# EAGLE design STM32F767ZI_eval_1 (EAGLE 7.7.0)

## Sheet 1 of 5
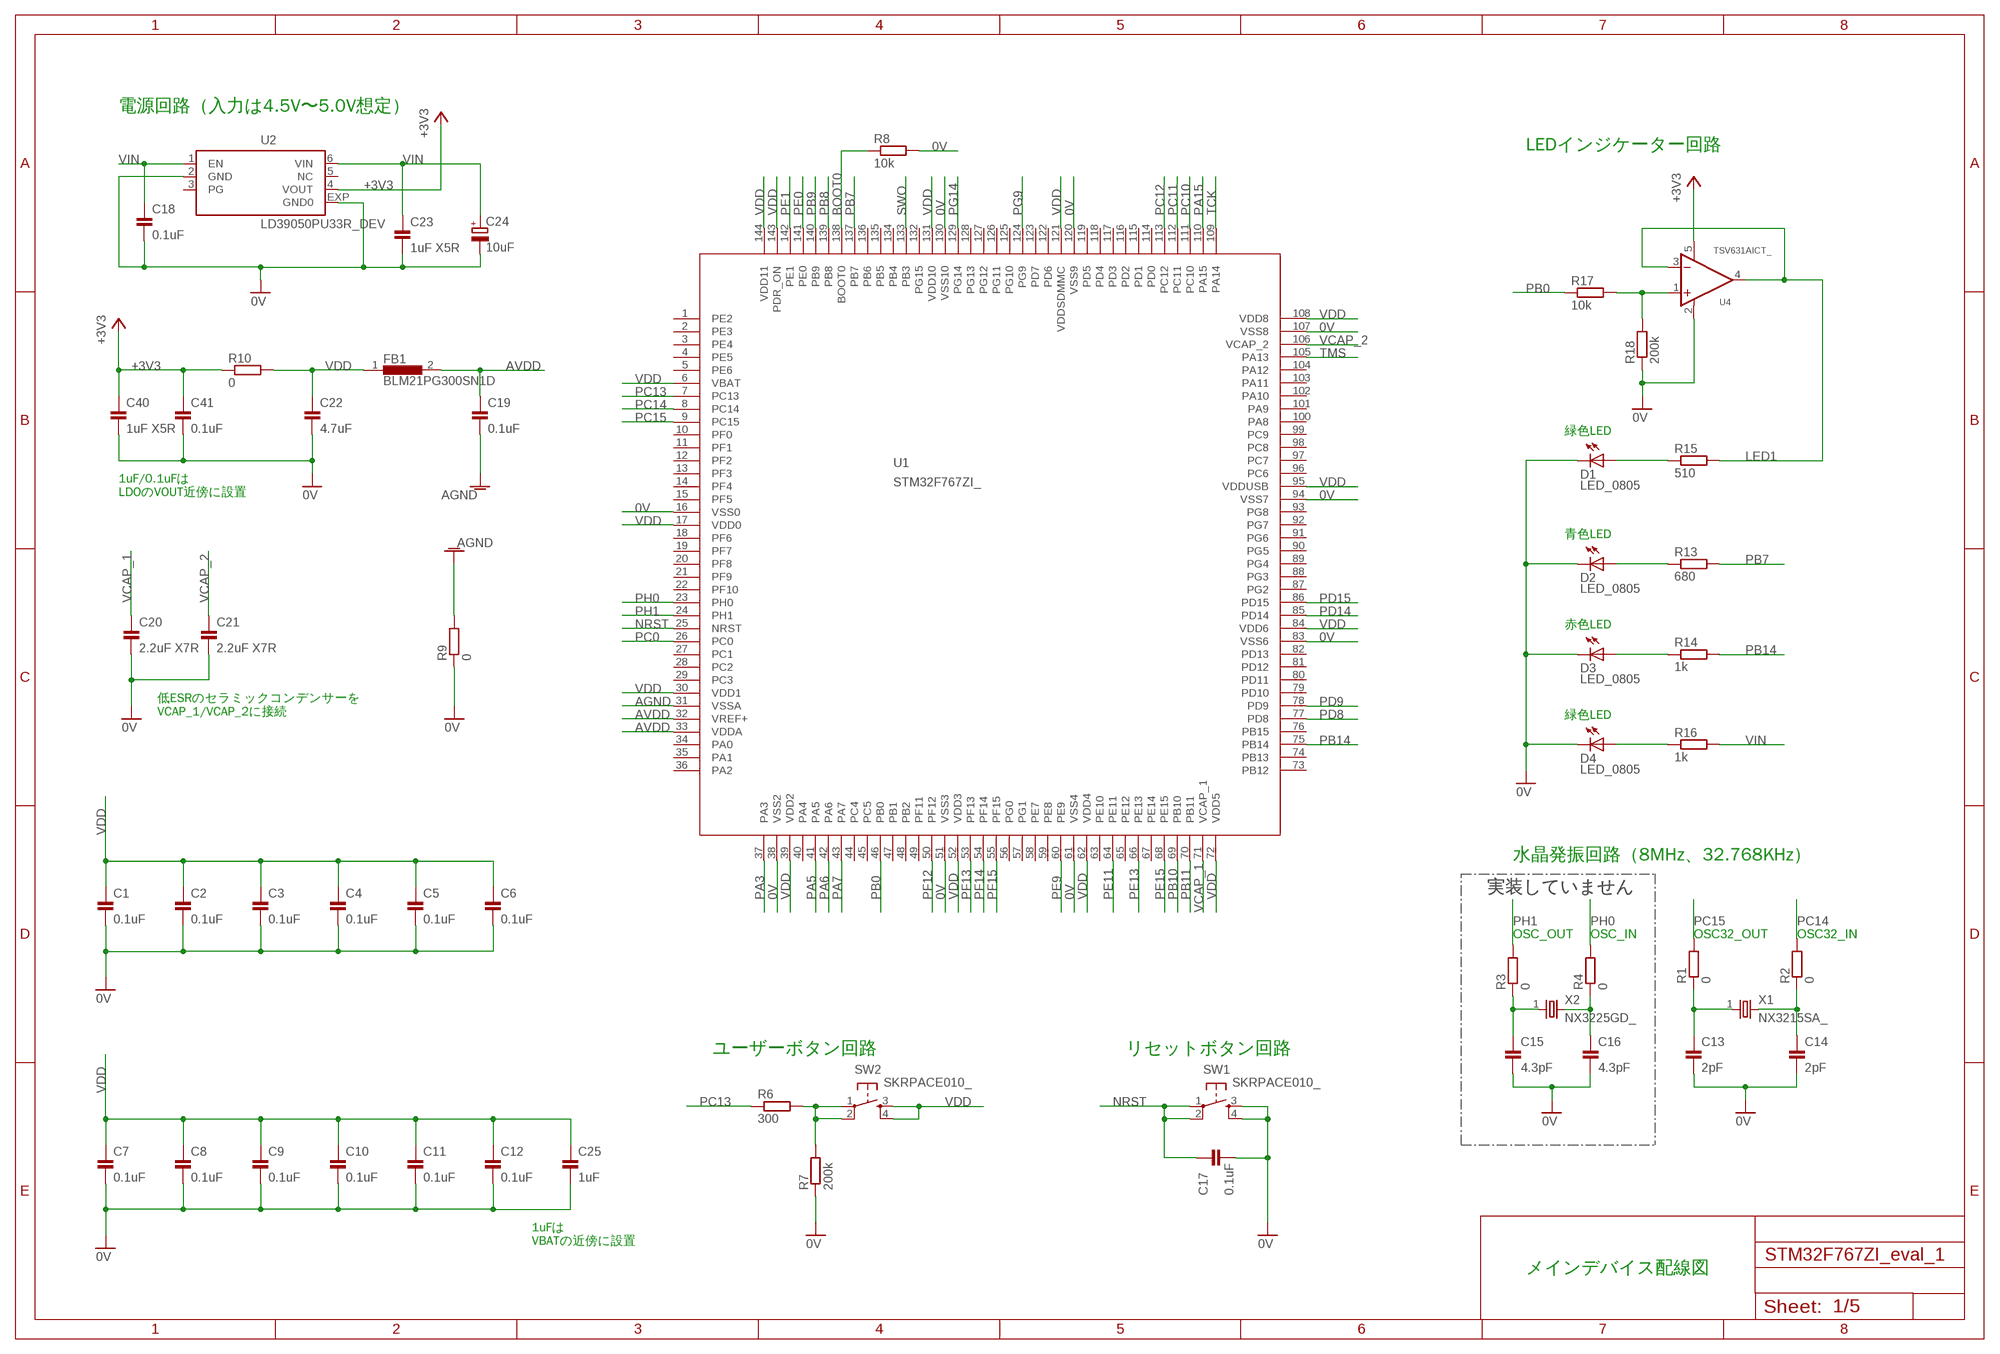
[diagram p0: schematic, sheet 1]

### Parts
C1  0.1uF  CAP_0603_DEV  [SMD_1608_DEV]
C2  0.1uF  CAP_0603_DEV  [SMD_1608_DEV]
C3  0.1uF  CAP_0603_DEV  [SMD_1608_DEV]
C4  0.1uF  CAP_0603_DEV  [SMD_1608_DEV]
C5  0.1uF  CAP_0603_DEV  [SMD_1608_DEV]
C6  0.1uF  CAP_0603_DEV  [SMD_1608_DEV]
C7  0.1uF  CAP_0603_DEV  [SMD_1608_DEV]
C8  0.1uF  CAP_0603_DEV  [SMD_1608_DEV]
C9  0.1uF  CAP_0603_DEV  [SMD_1608_DEV]
C10  0.1uF  CAP_0603_DEV  [SMD_1608_DEV]
C11  0.1uF  CAP_0603_DEV  [SMD_1608_DEV]
C12  0.1uF  CAP_0603_DEV  [SMD_1608_DEV]
C13  2pF  CAP_0603_DEV  [SMD_1608_DEV]
C14  2pF  CAP_0603_DEV  [SMD_1608_DEV]
C15  4.3pF  CAP_0603_DEV  [SMD_1608_DEV]
C16  4.3pF  CAP_0603_DEV  [SMD_1608_DEV]
C17  0.1uF  CAP_0603_DEV  [SMD_1608_DEV]
C18  0.1uF  CAP_0603_DEV  [SMD_1608_DEV]
C19  0.1uF  CAP_0603_DEV  [SMD_1608_DEV]
C20  2.2uF X7R  CAP_1206  [C1206]
C21  2.2uF X7R  CAP_1206  [C1206]
C22  4.7uF  CAP_0805_DEV  [SMD_2012_DEV]
C23  1uF X5R  CAP_0603_DEV  [SMD_1608_DEV]
C24  10uF  TPST106K016R0800_  [C1210_TPST_DEV]
C25  1uF  CAP_0603_DEV  [SMD_1608_DEV]
C40  1uF X5R  CAP_0603_DEV  [SMD_1608_DEV]
C41  0.1uF  CAP_0603_DEV  [SMD_1608_DEV]
D1  LED_0805  [CHIPLED_0805]
D2  LED_0805  [CHIPLED_0805]
D3  LED_0805  [CHIPLED_0805]
D4  LED_0805  [CHIPLED_0805]
FB1  BLM21PG300SN1D  [SMD_2012_DEV]
R1  0  RESISTOR_0603_DEV  [SMD_1608_DEV]
R2  0  RESISTOR_0603_DEV  [SMD_1608_DEV]
R3  0  RESISTOR_0603_DEV  [SMD_1608_DEV]
R4  0  RESISTOR_0603_DEV  [SMD_1608_DEV]
R6  300  RESISTOR_0603_DEV  [SMD_1608_DEV]
R7  200k  RESISTOR_0603_DEV  [SMD_1608_DEV]
R8  10k  RESISTOR_0603_DEV  [SMD_1608_DEV]
R9  0  RESISTOR_0603_DEV  [SMD_1608_DEV]
R10  0  RESISTOR_0603_DEV  [SMD_1608_DEV]
R13  680  RESISTOR_0603_DEV  [SMD_1608_DEV]
R14  1k  RESISTOR_0603_DEV  [SMD_1608_DEV]
R15  510  RESISTOR_0603_DEV  [SMD_1608_DEV]
R16  1k  RESISTOR_0603_DEV  [SMD_1608_DEV]
R17  10k  RESISTOR_0603_DEV  [SMD_1608_DEV]
R18  200k  RESISTOR_0603_DEV  [SMD_1608_DEV]
SW1  SKRPACE010_  [SKRPACE010_DEV]
SW2  SKRPACE010_  [SKRPACE010_DEV]
U1  STM32F767ZI_  [LQFP144_DEV]
U2  LD39050PU33R_DEV  [DFN6-3X3_]
U4  TSV631AICT_  [SC-70-5_DEV]
X1  NX3215SA_  [NX3215_DEV]
X2  NX3225GD_  [NX3225_DEV]

### Nets
0V: C1.2 C2.2 C3.2 C4.2 C5.2 C6.2 C7.2 C8.2 C9.2 C10.2 C11.2 C12.2 C13.2 C14.2 C15.2 C16.2 C17.2 C18.2 C20.2 C21.2 C22.2 C23.2 C24.2(-) C25.2 C40.2 C41.2 D1.C D2.C D3.C D4.C R7.1 R8.2 R9.1 R18.1 SW1.3(S) SW1.4(S1) U1.16(VSS0) U1.38(VSS2) U1.51(VSS3) U1.61(VSS4) U1.83(VSS6) U1.94(VSS7) U1.107(VSS8) U1.120(VSS9) U1.130(VSS10) U2.2(GND) U2.EXP(GND0) U4.2(V-) ; also sheet 2,3,4,5
+3V3: C40.1 C41.1 R10.1 U2.4(VOUT) U4.5(V+) ; also sheet 2,3,4
AGND: C19.2 R9.2 U1.31(VSSA)
AVDD: C19.1 FB1.2 U1.32(VREF+) U1.33(VDDA) ; also sheet 2
BOOT0: R8.1 U1.138(BOOT0)
LED1: R15.2 U4.3(IN-) U4.4(OUT)
N$1: C15.1 R3.1 X2.1
N$2: C14.1 R2.1 X1.2
N$3: C13.1 R1.1 X1.1
N$4: D2.A R13.1
N$5: C16.1 R4.1 X2.2
N$6: R6.2 R7.2 SW2.1(P) SW2.2(P1)
N$7: D3.A R14.1
N$9: R17.2 R18.2 U4.1(IN+)
N$10: D1.A R15.1
N$11: D4.A R16.1
NRST: C17.1 SW1.1(P) SW1.2(P1) U1.25(NRST) ; also sheet 2
PA3: U1.37(PA3) ; also sheet 2
PA5: U1.41(PA5) ; also sheet 2,3
PA6: U1.42(PA6) ; also sheet 2
PA7: U1.43(PA7) ; also sheet 2,3
PA15: U1.110(PA15) ; also sheet 4
PB0: R17.1 U1.46(PB0)
PB7: R13.2 U1.137(PB7)
PB8: U1.139(PB8) ; also sheet 2
PB9: U1.140(PB9) ; also sheet 2
PB10: U1.69(PB10) ; also sheet 5
PB11: U1.70(PB11) ; also sheet 5
PB14: R14.2 U1.75(PB14)
PC0: U1.26(PC0) ; also sheet 2
PC10: U1.111(PC10) ; also sheet 4
PC11: U1.112(PC11) ; also sheet 4
PC12: U1.113(PC12) ; also sheet 4
PC13: R6.1 U1.7(PC13)
PC14: R2.2 U1.8(PC14)
PC15: R1.2 U1.9(PC15)
PD8: U1.77(PD8) ; also sheet 2
PD9: U1.78(PD9) ; also sheet 2
PD14: U1.85(PD14) ; also sheet 2,3
PD15: U1.86(PD15) ; also sheet 2,3
PE0: U1.141(PE0) ; also sheet 2
PE1: U1.142(PE1) ; also sheet 2
PE9: U1.60(PE9) ; also sheet 2
PE11: U1.64(PE11) ; also sheet 2
PE13: U1.66(PE13) ; also sheet 2
PE15: U1.68(PE15) ; also sheet 5
PF12: U1.50(PF12) ; also sheet 2,3
PF13: U1.53(PF13) ; also sheet 2
PF14: U1.54(PF14) ; also sheet 2
PF15: U1.55(PF15) ; also sheet 2
PG9: U1.124(PG9) ; also sheet 2
PG14: U1.129(PG14) ; also sheet 2
PH0: R4.2 U1.23(PH0)
PH1: R3.2 U1.24(PH1)
SWO: U1.133(PB3) ; also sheet 2
TCK: U1.109(PA14) ; also sheet 2
TMS: U1.105(PA13) ; also sheet 2
VCAP_1: C20.1 U1.71(VCAP_1)
VCAP_2: C21.1 U1.106(VCAP_2)
VDD: C1.1 C2.1 C3.1 C4.1 C5.1 C6.1 C7.1 C8.1 C9.1 C10.1 C11.1 C12.1 C22.1 C25.1 FB1.1 R10.2 SW2.3(S) SW2.4(S1) U1.6(VBAT) U1.17(VDD0) U1.30(VDD1) U1.39(VDD2) U1.52(VDD3) U1.62(VDD4) U1.72(VDD5) U1.84(VDD6) U1.95(VDDUSB) U1.108(VDD8) U1.121(VDDSDMMC) U1.131(VDD10) U1.143(PDR_ON) U1.144(VDD11) ; also sheet 5
VIN: C18.1 C23.1 C24.1(+) R16.2 U2.1(EN) U2.6(VIN) ; also sheet 2
Unconnected: U1.1(PE2) U1.2(PE3) U1.3(PE4) U1.4(PE5) U1.5(PE6) U1.10(PF0) U1.11(PF1) U1.12(PF2) U1.13(PF3) U1.14(PF4) U1.15(PF5) U1.18(PF6) U1.19(PF7) U1.20(PF8) U1.21(PF9) U1.22(PF10) U1.27(PC1) U1.28(PC2) U1.29(PC3) U1.34(PA0) U1.35(PA1) U1.36(PA2) U1.40(PA4) U1.44(PC4) U1.45(PC5) U1.47(PB1) U1.48(PB2) U1.49(PF11) U1.56(PG0) U1.57(PG1) U1.58(PE7) U1.59(PE8) U1.63(PE10) U1.65(PE12) U1.67(PE14) U1.73(PB12) U1.74(PB13) U1.76(PB15) U1.79(PD10) U1.80(PD11) U1.81(PD12) U1.82(PD13) U1.87(PG2) U1.88(PG3) U1.89(PG4) U1.90(PG5) U1.91(PG6) U1.92(PG7) U1.93(PG8) U1.96(PC6) U1.97(PC7) U1.98(PC8) U1.99(PC9) U1.100(PA8) U1.101(PA9) U1.102(PA10) U1.103(PA11) U1.104(PA12) U1.114(PD0) U1.115(PD1) U1.116(PD2) U1.117(PD3) U1.118(PD4) U1.119(PD5) U1.122(PD6) U1.123(PD7) U1.125(PG10) U1.126(PG11) U1.127(PG12) U1.128(PG13) U1.132(PG15) U1.134(PB4) U1.135(PB5) U1.136(PB6) U2.3(PG) U2.5(NC)

### Notes on the sheet
- 電源回路（入力は4.5V〜5.0V想定）
- LEDインジケーター回路
- 緑色LED
- 1uF/0.1uFは
  LDOのVOUT近傍に設置
- 青色LED
- 赤色LED
- 低ESRのセラミックコンデンサーを
  VCAP_1/VCAP_2に接続
- 緑色LED
- 水晶発振回路（8MHz、32.768KHz）
- 実装していません | 実装していません
- OSC_OUT | OSC_IN | OSC32_OUT | OSC32_IN
- ユーザーボタン回路 | リセットボタン回路
- 1uFは
  VBATの近傍に設置
- メインデバイス配線図

## Sheet 2 of 5
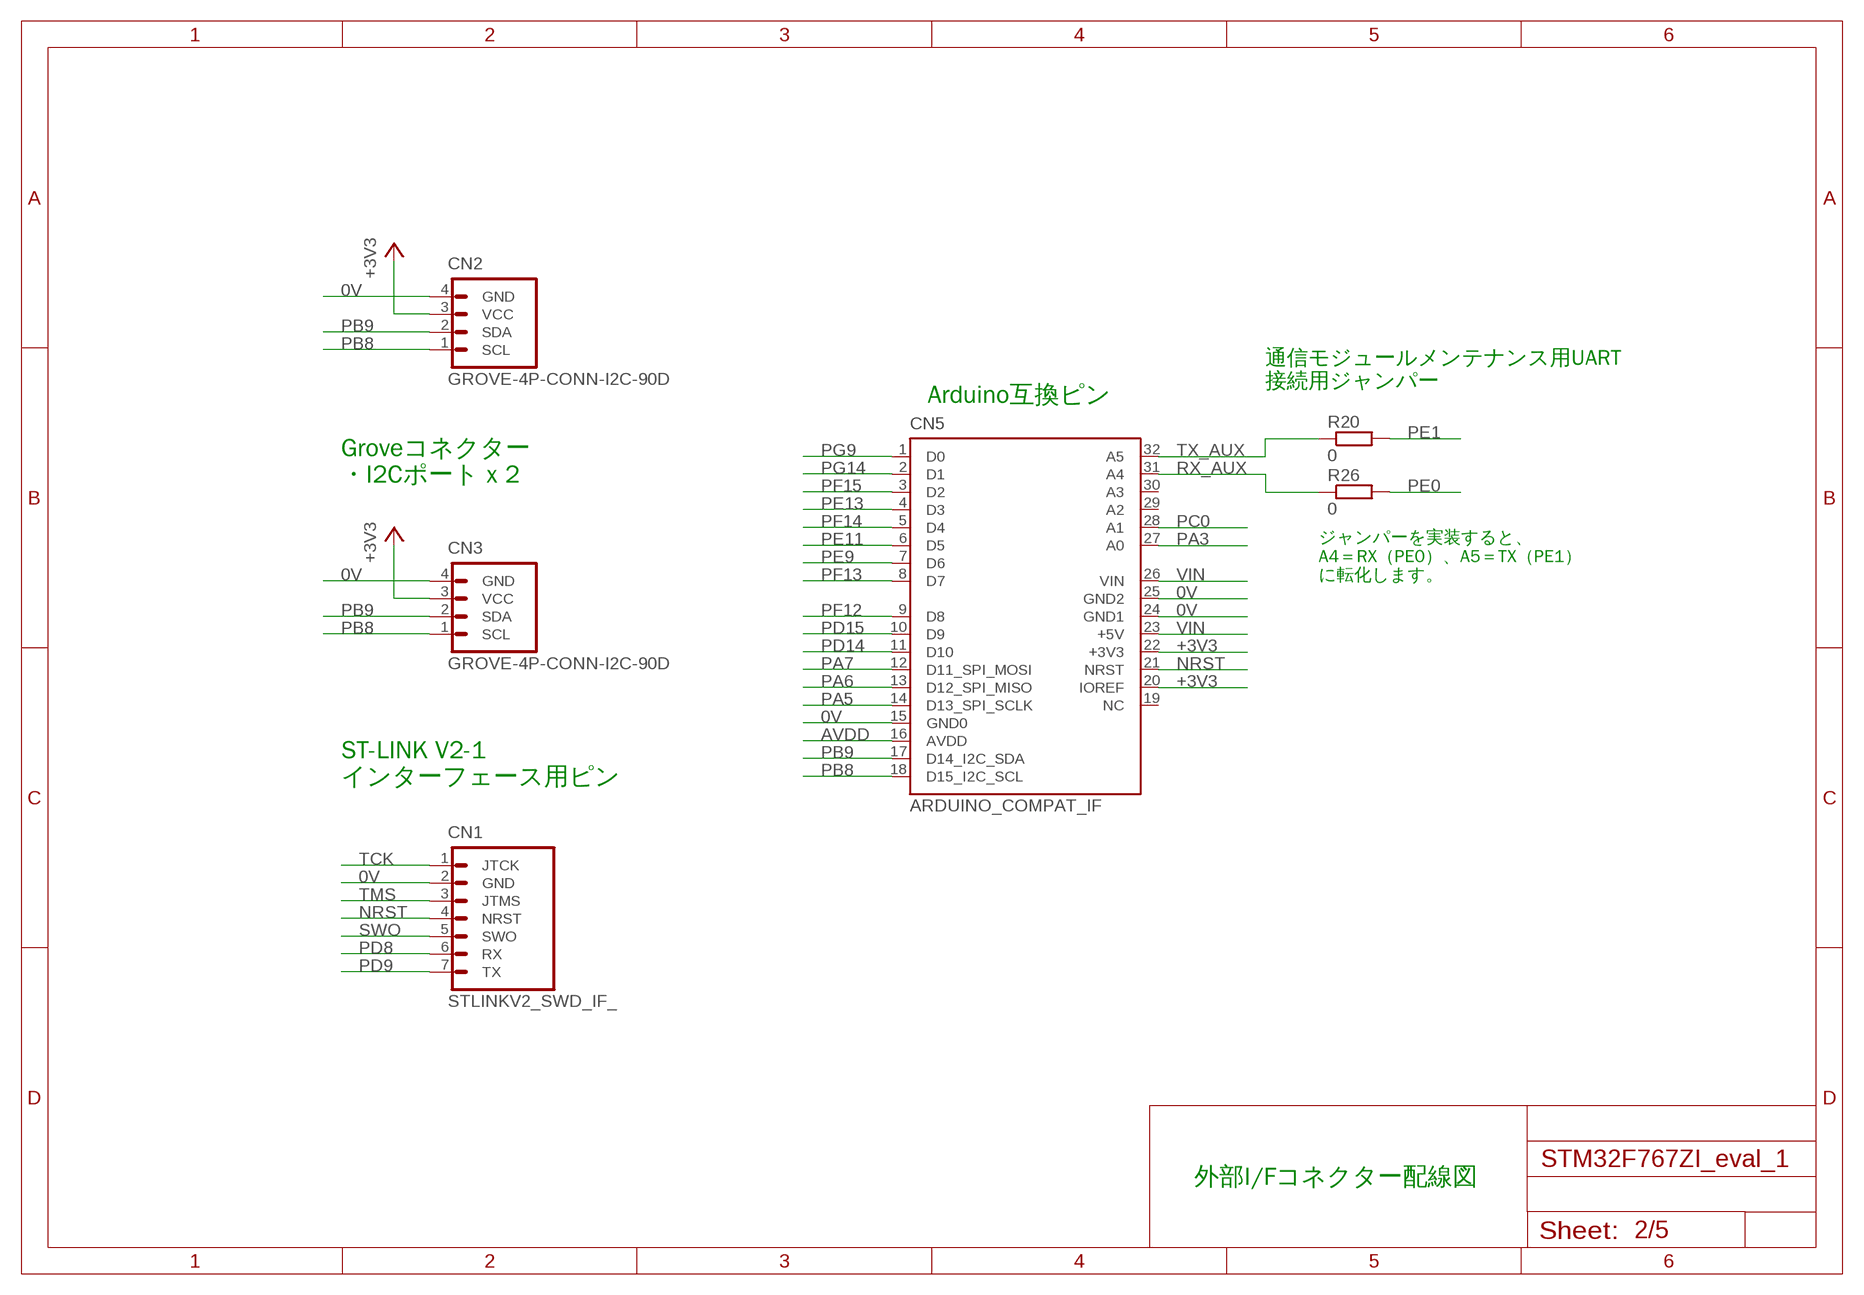
[diagram p1: schematic, sheet 2]

### Parts
CN1  STLINKV2_SWD_IF_  [DF65-7P-1.7V_DEV]
CN2  GROVE-4P-CONN-I2C-90D  [GROVE-4P-90D]
CN3  GROVE-4P-CONN-I2C-90D  [GROVE-4P-90D]
CN5  ARDUINO_COMPAT_IF  [ARDUINO_COMPAT_IF]
R20  0  RESISTOR_0603_DEV  [SMD_1608_DEV]
R26  0  RESISTOR_0603_DEV  [SMD_1608_DEV]

### Nets
0V: CN1.2(GND) CN2.4(GND) CN3.4(GND) CN5.15(GND0) CN5.24(GND1) CN5.25(GND2) ; also sheet 1,3,4,5
+3V3: CN2.3(VCC) CN3.3(VCC) CN5.20(IOREF) CN5.22(+3V3) ; also sheet 1,3,4
AVDD: CN5.16(AVDD) ; also sheet 1
NRST: CN1.4(NRST) CN5.21(NRST) ; also sheet 1
PA3: CN5.27(A0) ; also sheet 1
PA5: CN5.14(D13_SPI_SCLK) ; also sheet 1,3
PA6: CN5.13(D12_SPI_MISO) ; also sheet 1
PA7: CN5.12(D11_SPI_MOSI) ; also sheet 1,3
PB8: CN2.1(SCL) CN3.1(SCL) CN5.18(D15_I2C_SCL) ; also sheet 1
PB9: CN2.2(SDA) CN3.2(SDA) CN5.17(D14_I2C_SDA) ; also sheet 1
PC0: CN5.28(A1) ; also sheet 1
PD8: CN1.6(RX) ; also sheet 1
PD9: CN1.7(TX) ; also sheet 1
PD14: CN5.11(D10) ; also sheet 1,3
PD15: CN5.10(D9) ; also sheet 1,3
PE0: R26.2 ; also sheet 1
PE1: R20.2 ; also sheet 1
PE9: CN5.7(D6) ; also sheet 1
PE11: CN5.6(D5) ; also sheet 1
PE13: CN5.4(D3) ; also sheet 1
PF12: CN5.9(D8) ; also sheet 1,3
PF13: CN5.8(D7) ; also sheet 1
PF14: CN5.5(D4) ; also sheet 1
PF15: CN5.3(D2) ; also sheet 1
PG9: CN5.1(D0) ; also sheet 1
PG14: CN5.2(D1) ; also sheet 1
RX_AUX: CN5.31(A4) R26.1
SWO: CN1.5(SWO) ; also sheet 1
TCK: CN1.1(JTCK) ; also sheet 1
TMS: CN1.3(JTMS) ; also sheet 1
TX_AUX: CN5.32(A5) R20.1
VIN: CN5.23(+5V) CN5.26(VIN) ; also sheet 1
Unconnected: CN5.19(NC) CN5.29(A2) CN5.30(A3)

### Notes on the sheet
- 通信モジュールメンテナンス用UART
  接続用ジャンパー
- Arduino互換ピン
- Groveコネクター
  ・I2Cポート x 2
- ジャンパーを実装すると、
  A4＝RX（PE0）、A5＝TX（PE1）
  に転化します。
- ST-LINK V2-1
  インターフェース用ピン
- 外部I/Fコネクター配線図

## Sheet 3 of 5
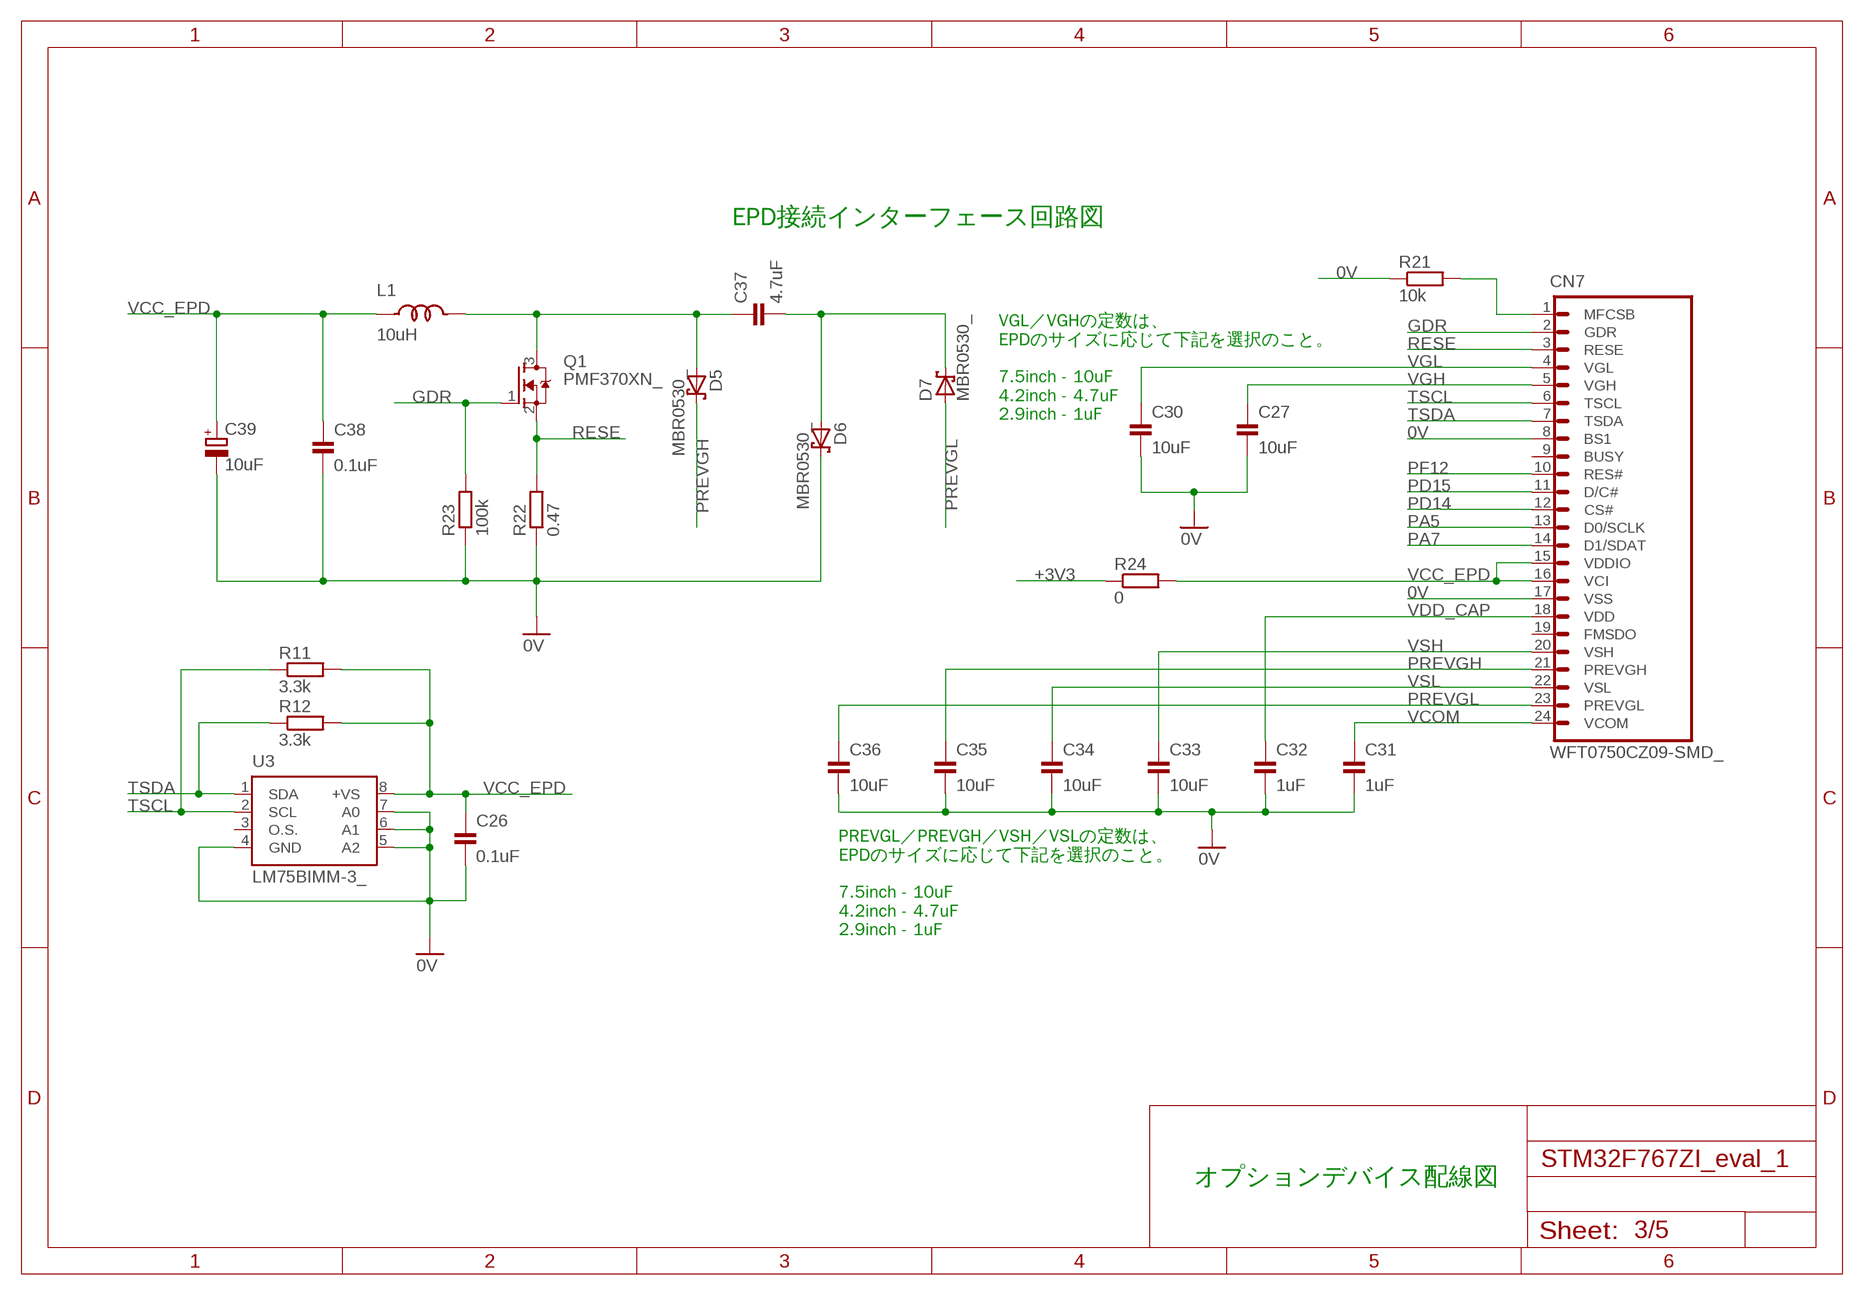
[diagram p2: schematic, sheet 3]

### Parts
C26  0.1uF  CAP_0603_DEV  [SMD_1608_DEV]
C27  10uF  CAP_0805_DEV  [SMD_2012_DEV]
C30  10uF  CAP_0805_DEV  [SMD_2012_DEV]
C31  1uF  CAP_0805_DEV  [SMD_2012_DEV]
C32  1uF  CAP_0805_DEV  [SMD_2012_DEV]
C33  10uF  CAP_0805_DEV  [SMD_2012_DEV]
C34  10uF  CAP_0805_DEV  [SMD_2012_DEV]
C35  10uF  CAP_0805_DEV  [SMD_2012_DEV]
C36  10uF  CAP_0805_DEV  [SMD_2012_DEV]
C37  4.7uF  CAP_0805_DEV  [SMD_2012_DEV]
C38  0.1uF  CAP_0603_DEV  [SMD_1608_DEV]
C39  10uF  TPST106K016R0800_  [C1210_TPST_DEV]
CN7  WFT0750CZ09-SMD_  [FH12A-24S-0.5SH_DEV]
D5  MBR0530_  [MBR0530_DEV]
D6  MBR0530_  [MBR0530_DEV]
D7  MBR0530_  [MBR0530_DEV]
L1  10uH  NLCV25T_  [NLCV25T_DEV]
Q1  PMF370XN_  [SOT323_DEV]
R11  3.3k  RESISTOR_0805_DEV  [SMD_2012_DEV]
R12  3.3k  RESISTOR_0805_DEV  [SMD_2012_DEV]
R21  10k  RESISTOR_0603_DEV  [SMD_1608_DEV]
R22  0.47  RESISTOR_0805_DEV  [SMD_2012_DEV]
R23  100k  RESISTOR_0805_DEV  [SMD_2012_DEV]
R24  0  RESISTOR_0603_DEV  [SMD_1608_DEV]
U3  LM75BIMM-3_  [SSOP8-DGK_DEV]

### Nets
0V: C26.2 C27.2 C30.2 C31.2 C32.2 C33.2 C34.2 C35.2 C36.2 C38.2 C39.2(-) CN7.8(BS1) CN7.17(VSS) D6.1(C) R21.1 R22.1 R23.1 U3.4(GND) U3.5(A2) U3.6(A1) U3.7(A0) ; also sheet 1,2,4,5
+3V3: R24.1 ; also sheet 1,2,4
GDR: CN7.2(GDR) Q1.1(G) R23.2
N$8: CN7.1(MFCSB) R21.2
N$13: C37.1 D5.2(A) L1.2 Q1.3(D)
N$14: C37.2 D6.2(A) D7.1(C)
PA5: CN7.13(D0/SCLK) ; also sheet 1,2
PA7: CN7.14(D1/SDAT) ; also sheet 1,2
PD14: CN7.12(CS#) ; also sheet 1,2
PD15: CN7.11(D/C#) ; also sheet 1,2
PF12: CN7.10(RES#) ; also sheet 1,2
PREVGH: C35.1 CN7.21(PREVGH) D5.1(C)
PREVGL: C36.1 CN7.23(PREVGL) D7.2(A)
RESE: CN7.3(RESE) Q1.2(S) R22.2
TSCL: CN7.6(TSCL) R11.1 U3.2(SCL)
TSDA: CN7.7(TSDA) R12.1 U3.1(SDA)
VCC_EPD: C26.1 C38.1 C39.1(+) CN7.15(VDDIO) CN7.16(VCI) L1.1 R11.2 R12.2 R24.2 U3.8(+VS)
VCOM: C31.1 CN7.24(VCOM)
VDD_CAP: C32.1 CN7.18(VDD)
VGH: C27.1 CN7.5(VGH)
VGL: C30.1 CN7.4(VGL)
VSH: C33.1 CN7.20(VSH)
VSL: C34.1 CN7.22(VSL)
Unconnected: CN7.9(BUSY) CN7.19(FMSDO) U3.3(O.S.)

### Notes on the sheet
- EPD接続インターフェース回路図
- VGL／VGHの定数は、
  EPDのサイズに応じて下記を選択のこと。
  
  7.5inch - 10uF
  4.2inch - 4.7uF
  2.9inch - 1uF
- PREVGL／PREVGH／VSH／VSLの定数は、
  EPDのサイズに応じて下記を選択のこと。
  
  7.5inch - 10uF
  4.2inch - 4.7uF
  2.9inch - 1uF
- オプションデバイス配線図

## Sheet 4 of 5
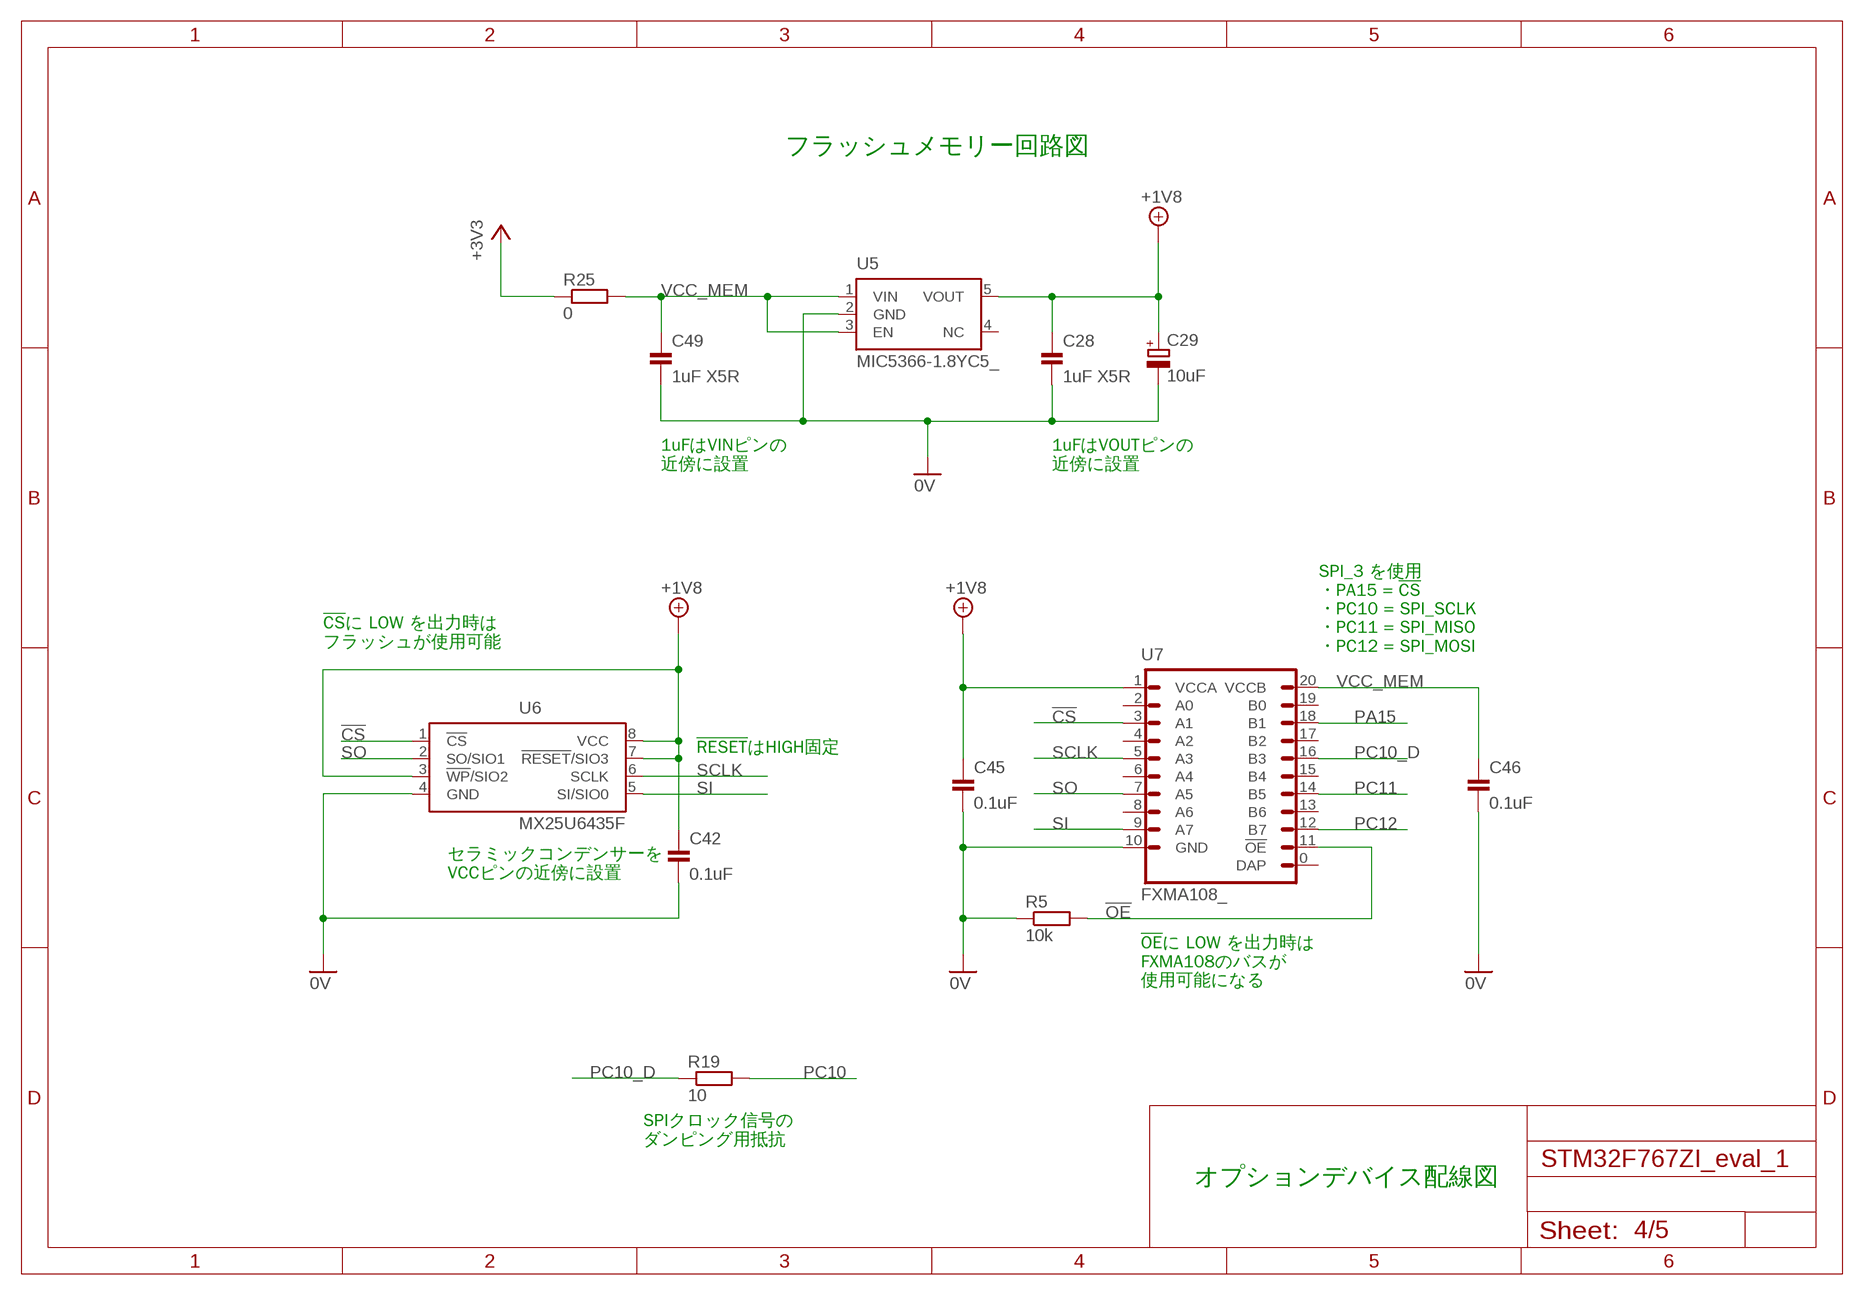
[diagram p3: schematic, sheet 4]

### Parts
C28  1uF X5R  CAP_0603_DEV  [SMD_1608_DEV]
C29  10uF  TPST106K016R0800_  [C1210_TPST_DEV]
C42  0.1uF  CAP_0603_DEV  [SMD_1608_DEV]
C45  0.1uF  CAP_0603_DEV  [SMD_1608_DEV]
C46  0.1uF  CAP_0603_DEV  [SMD_1608_DEV]
C49  1uF X5R  CAP_0603_DEV  [SMD_1608_DEV]
R5  10k  RESISTOR_0603_DEV  [SMD_1608_DEV]
R19  10  RESISTOR_0603_DEV  [SMD_1608_DEV]
R25  0  RESISTOR_0603_DEV  [SMD_1608_DEV]
U5  MIC5366-1.8YC5_  [SC-70-5_DEV]
U6  MX25U6435F  [SOP_8L]
U7  FXMA108_  [DQFN20_DEV]

### Nets
0V: C28.2 C29.2(-) C42.2 C45.2 C46.2 C49.2 R5.1 U5.2(GND) U6.4(GND) U7.10(GND) ; also sheet 1,2,3,5
!CS!: U6.1(!CS) U7.3(A1)
!OE!: R5.2 U7.11(!OE!)
+1V8: C28.1 C29.1(+) C42.1 C45.1 U5.5(VOUT) U6.3(!WP!/SIO2) U6.7(!RESET!/SIO3) U6.8(VCC) U7.1(VCCA)
+3V3: R25.1 ; also sheet 1,2,3
PA15: U7.18(B1) ; also sheet 1
PC10: R19.2 ; also sheet 1
PC10_D: R19.1 U7.16(B3)
PC11: U7.14(B5) ; also sheet 1
PC12: U7.12(B7) ; also sheet 1
SCLK: U6.6(SCLK) U7.5(A3)
SI: U6.5(SI/SIO0) U7.9(A7)
SO: U6.2(SO/SIO1) U7.7(A5)
VCC_MEM: C46.1 C49.1 R25.2 U5.1(VIN) U5.3(EN) U7.20(VCCB)
Unconnected: U5.4(NC) U7.0(DAP) U7.2(A0) U7.4(A2) U7.6(A4) U7.8(A6) U7.13(B6) U7.15(B4) U7.17(B2) U7.19(B0)

### Notes on the sheet
- フラッシュメモリー回路図
- 1uFはVINピンの
  近傍に設置
- 1uFはVOUTピンの
  近傍に設置
- !CS!に LOW を出力時は
  フラッシュが使用可能
- SPI_3 を使用
  ・PA15 = !CS!
  ・PC10 = SPI_SCLK 
  ・PC11 = SPI_MISO 
  ・PC12 = SPI_MOSI
- !RESET!はHIGH固定
- セラミックコンデンサーを
  VCCピンの近傍に設置
- !OE!に LOW を出力時は
  FXMA108のバスが
  使用可能になる
- SPIクロック信号の
  ダンピング用抵抗
- オプションデバイス配線図

## Sheet 5 of 5
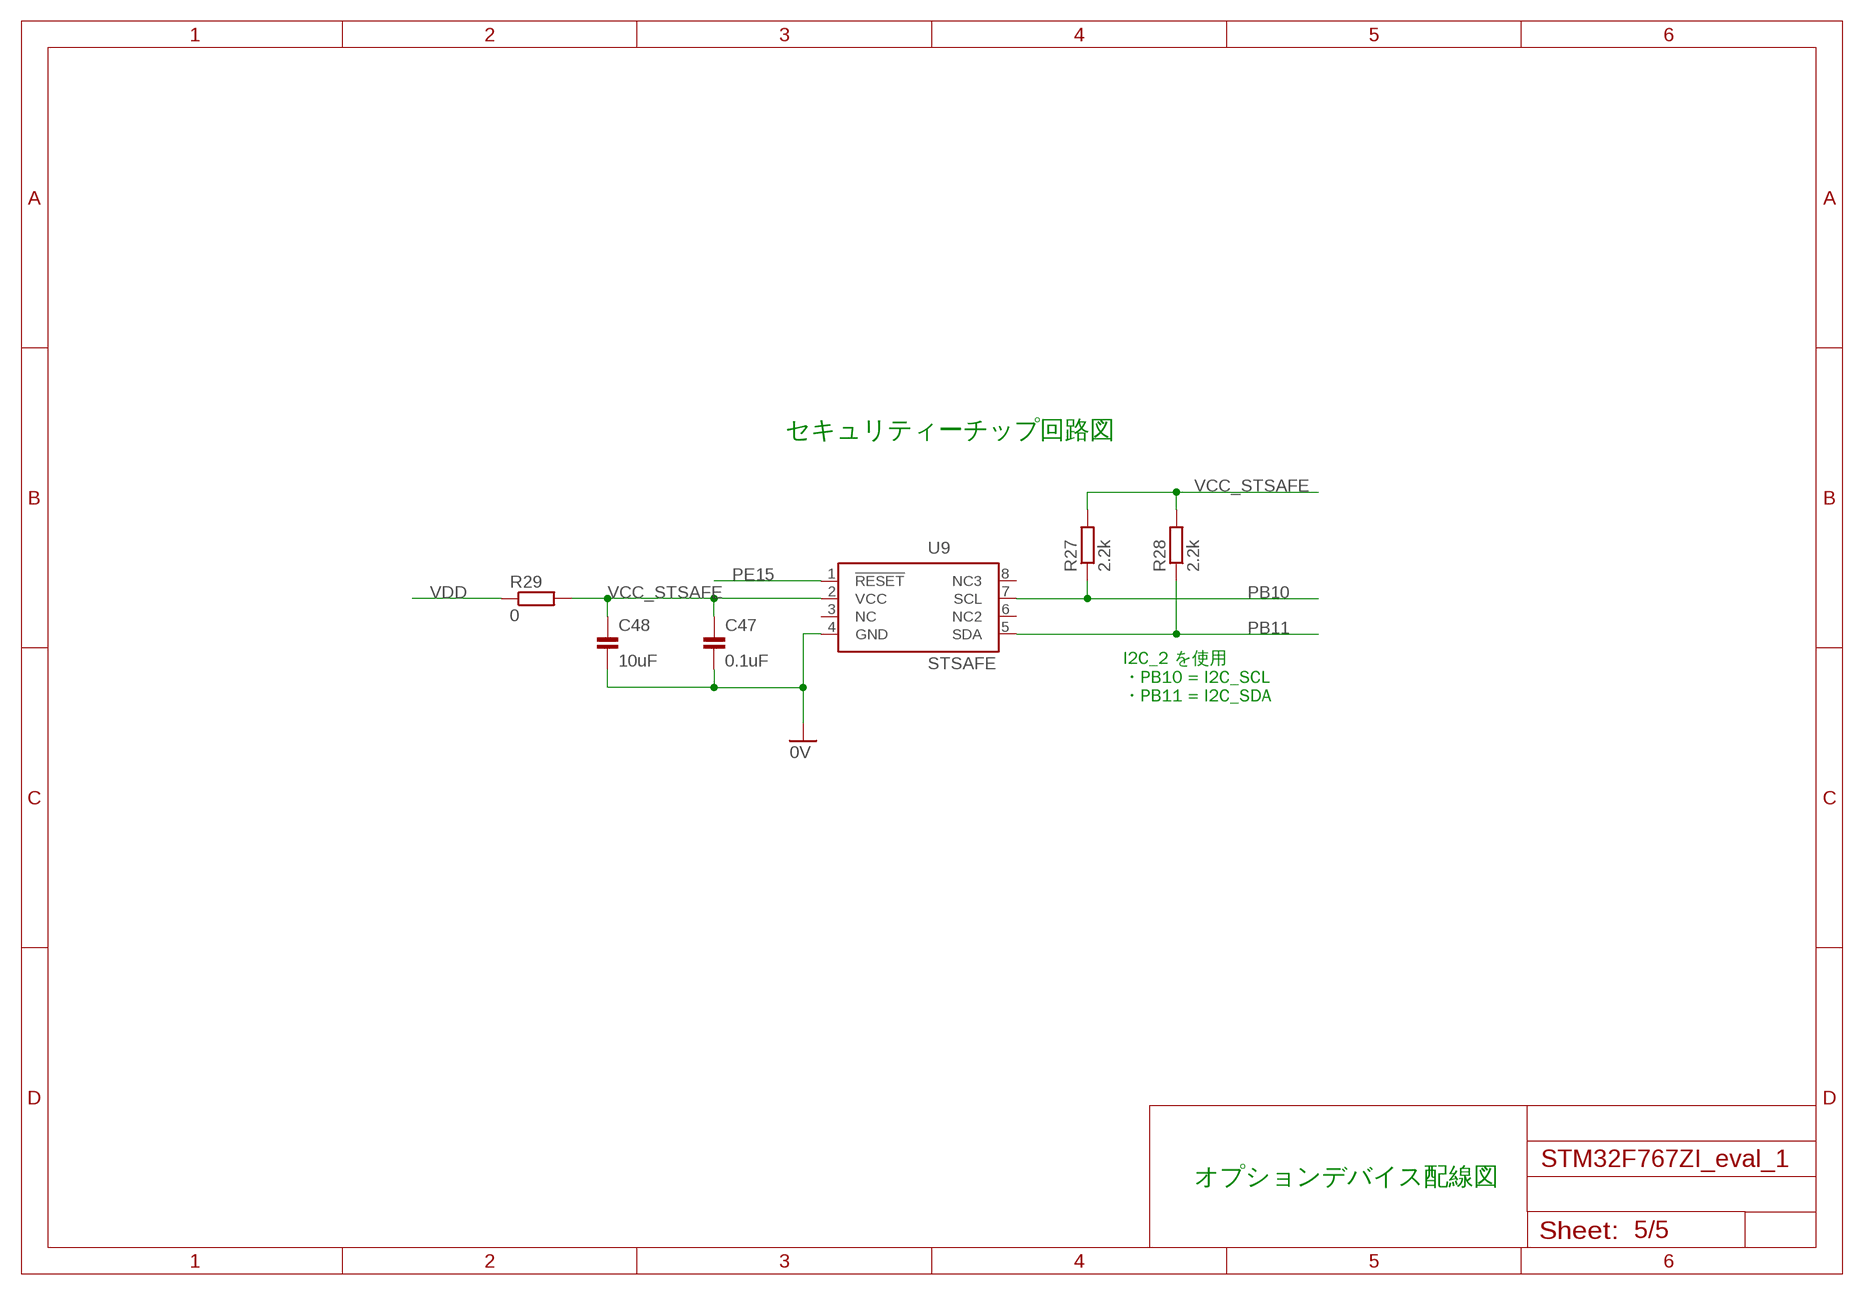
[diagram p4: schematic, sheet 5]

### Parts
C47  0.1uF  CAP_0603_DEV  [SMD_1608_DEV]
C48  10uF  CAP_0805_DEV  [SMD_2012_DEV]
R27  2.2k  RESISTOR_0603_DEV  [SMD_1608_DEV]
R28  2.2k  RESISTOR_0603_DEV  [SMD_1608_DEV]
R29  0  RESISTOR_0603_DEV  [SMD_1608_DEV]
U9  STSAFE  [SO8N]

### Nets
0V: C47.2 C48.2 U9.4(GND) ; also sheet 1,2,3,4
PB10: R27.1 U9.7(SCL) ; also sheet 1
PB11: R28.1 U9.5(SDA) ; also sheet 1
PE15: U9.1(!RESET!) ; also sheet 1
VCC_STSAFE: C47.1 C48.1 R27.2 R28.2 R29.2 U9.2(VCC)
VDD: R29.1 ; also sheet 1
Unconnected: U9.3(NC) U9.6(NC2) U9.8(NC3)

### Notes on the sheet
- セキュリティーチップ回路図
- I2C_2 を使用
  ・PB10 = I2C_SCL 
  ・PB11 = I2C_SDA
- オプションデバイス配線図

## Library data of the parts
C1-C23 C25-C28 C30-C38 C40-C42 C45-C49 = Parts:CAP: コンデンサー
C24 C29 C39 = Parts:TPST*: タンタルコンデンサ TPST106K016R0800 10µF ±10% 16V ESR（等価直列抵抗）: 0.8オーム 動作温度 : -55°C～125°C サイズ : 3.50mm x 2.80mm
CN1 = Connectors:STLINKV2_SWD_IF: ST-LINK V2-1用 SWDインターフェース #1-#5は、NUCLEO-F767ZI付属のST-LINK V2-1上のCN6[#2-#6]と接続 （CN6側の#1には接続しません） #6,#7は、NUCLEO-F767ZI付属のST-LINK V2-1上のCN5[#1-#2]と接続 +5Vは、NUCLEOのJP3[U5V]から別途供給
CN2 CN3 = PartsForProto:GROVE-4P-CONN-I2C: GROVE 4ピンコネクタ（I2C）
CN5 = PartsForProto:ARDUINO_COMPAT_IF: Arduino互換ピンインターフェース
CN7 = PartsForProto:WFT0750CZ09: インターフェースピン
D1-D4 = Parts:LED: 発光ダイオード
D5-D7 = Parts:MBR0530: ショットキーダイオード
FB1 = Parts:BLM21PG: フェライトビーズ EMIFIL® 周波数あたりのインピーダンス : 30オーム @ 100MHz 電流定格（最大） : 4A DC抵抗（DCR）（最大）: 14ミリオーム 動作温度 : -55°C～125°C
L1 = Parts:NLCV*: LEAD INDUCTOR
Q1 = Parts:PMF370XN: N-Channel 30 V (D-S) MOSFET
R1-R29 = Parts:RESISTOR: 抵抗器
SW1 SW2 = Parts:SKRPACE010: 表面実装用タクトスイッチ ４．２×３．２ｍｍ小型重作動力タイプ ・作動力：２．５５Ｎ ・操作方向：垂直 ・移動量：０．２ｍｍ ・動作寿命：５０，０００ｃｙｃｌｅｓ （５ｍＡ ５ＶＤＣ） ・初期接触抵抗：最大５００ｍΩ
U1 = Parts:STM32F767ZI: Arm Cortex-M7 32b MCU+FPU
U2 = Parts:LD39050PU33R: LDO電圧レギュレータ 出力電圧: 3.3 V 出力電流: 500 mA 入力電圧最大値: 5.5 V 最小入力電圧: + 1.5 V 出力タイプ: Fixed 最低動作温度: - 40 C 最高動作温度: + 125 C
U3 = Parts:LM75B*: 基板取付型温度センサー
U4 = Parts:TSV631AICT: オペレーショナル・アンプ 出力電流 (各チャンネル): 63 mA GBP - ゲイン帯域幅製品: 880 kHz 動作供給電圧: 1.5 V to 5.5 V Vos - 入力オフセット電圧: 500 uV 動作供給電流: 60 uA 最高動作温度: + 125 C 最低動作温度: - 40 C
U5 = Parts:MIC5366: LDO電圧レギュレータ 出力電圧: 1.8 V 出力電流: 150 mA 入力電圧最大値: 5.5 V 最低動作温度: - 40 C 最高動作温度: + 125 C ドロップアウト電圧 - 最大: 380 mV
U6 = Parts:MX25U6435F: 1.8V 64M-BIT FLASH MEMORY
U7 = Parts:FXMA108: ２電源双方向レベル変換IC 電源電圧:1.65V~5.5V (絶対最大定格:7.0V)
U9 = Parts:STSAFE
X1 = Parts:NX3215SA: 水晶振動子 周波数 32.768kHz 周波数公差 ±20ppm 負荷容量 6pF ESR（等価直列抵抗） 70 kOhms 動作温度 -40°C～85°C
X2 = Parts:NX3225GD: 水晶振動子 周波数 8MHz 周波数安定性 ±150ppm 周波数公差 ±50ppm 負荷容量 8pF ESR（等価直列抵抗） 500 Ohms 動作温度 -40°C～150°C 定格 AEC-Q200

## Board
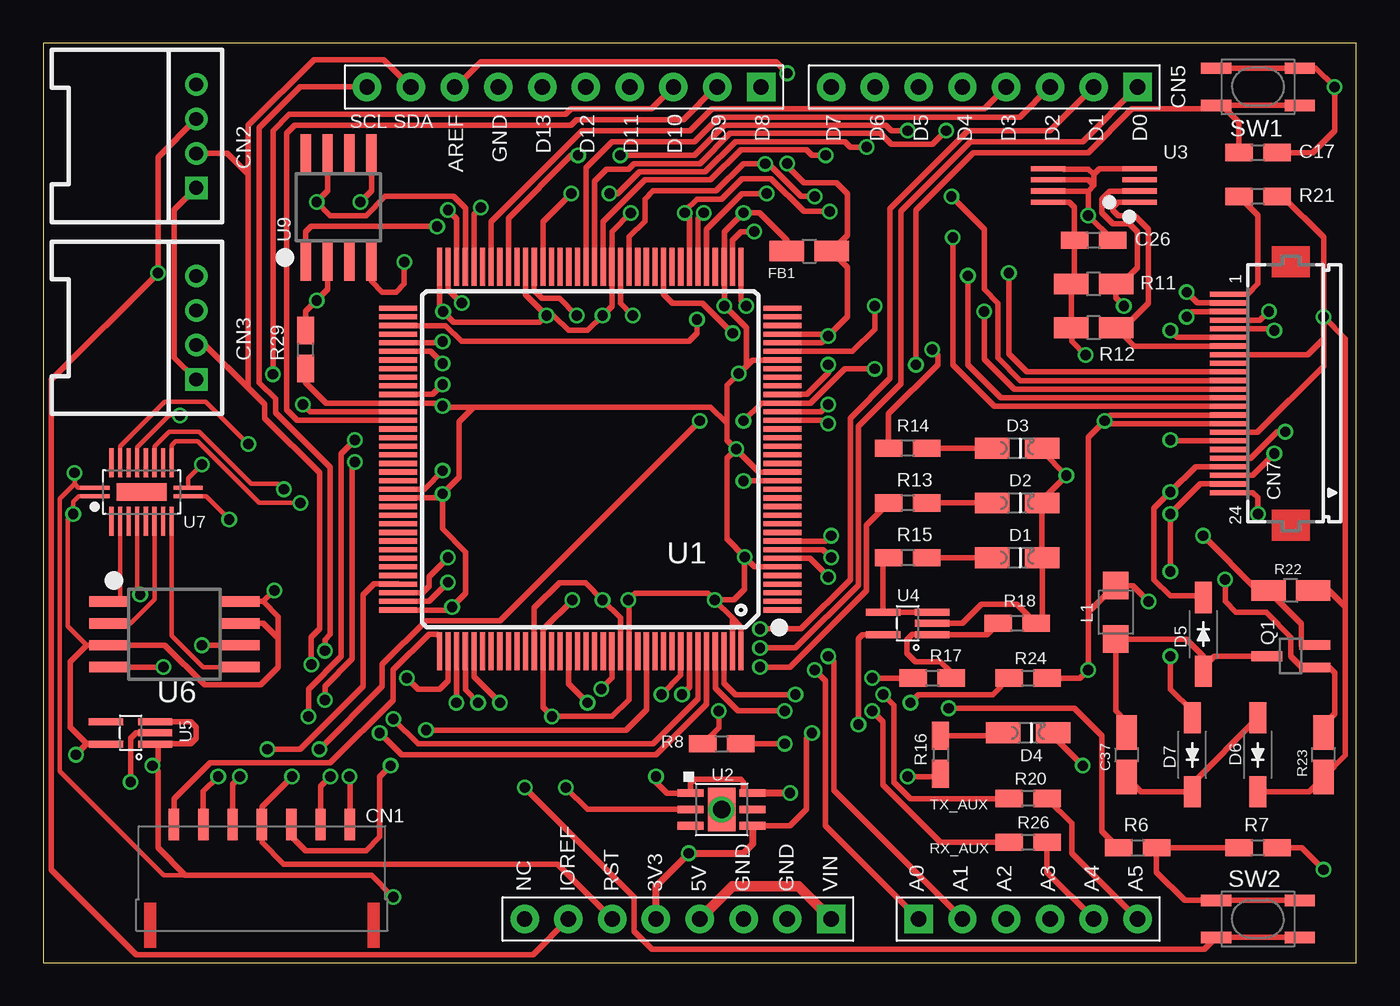
[diagram p5: board, top side]
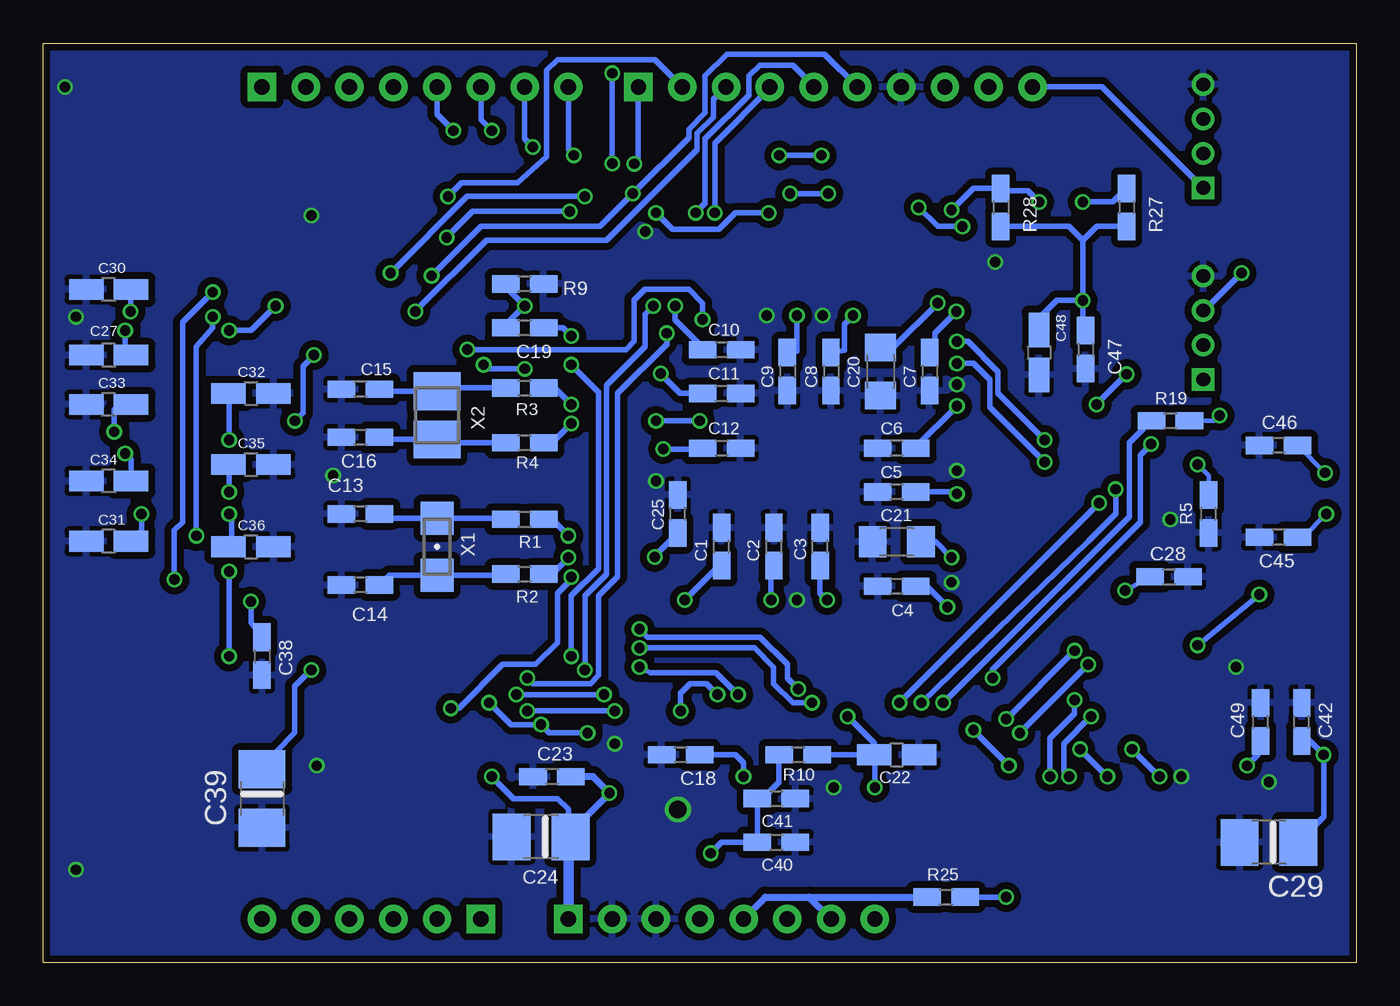
[diagram p6: board, bottom side, seen from below]

Size 76.2 x 53.34 mm. Coordinates in mm from the lower left corner, seen from the top.
Outline: 0,0 76.2,0 76.2,53.34 0,53.34 0,0
Copper layers (1*16): Top 0.035mm / dielectric 1.5mm / Bottom 0.035mm
Design rules "SeeedStudio_2layer_DRU_no_angle_20140221": minimum track width 6mil, minimum drill 12mil, track to track 6mil, track to pad 6mil, pad to pad 6mil, via to via 6mil, smd to smd 0mil, copper to edge 10mil, drill to drill 10mil, minimum pad ring 10mil, minimum via ring 6mil, stop-mask expansion 2mil, vias tented up to drill 100mil, thermal gap 10mil

### Footprints (pad centres in the part's own frame; a part is rotated, then mirrored left to right if it is on the bottom)
SMD_1608_DEV = smd 1.6 x 1: 1 -1.1,0; 2 1.1,0
C1206 = smd 1.6 x 1.8: 1 -1.4,0; 2 1.4,0
SMD_2012_DEV = smd 2 x 1.2: 1 -1.3,0; 2 1.3,0
C1210_TPST_DEV = smd 2.2 x 2.7: 1 -1.7,0; 2 1.7,0
DF65-7P-1.7V_DEV = smd 0.6 x 1.8: 1 -5.1,0.4; 2 -3.4,0.4; 3 -1.7,0.4; 4 0,0.4; 5 1.7,0.4; 6 3.4,0.4; 7 5.1,0.4
GROVE-4P-90D = drill 0.8 pad 1.27 square: 1 -3,0 | drill 0.8 pad 1.27: 2 -1,0; 3 1,0; 4 3,0
ARDUINO_COMPAT_IF = drill 0.889 pad 1.651 square: 1 63.5,50.8; 9 41.656,50.8; 26 45.72,2.54; 27 50.8,2.54 | drill 0.889 pad 1.651: 2 60.96,50.8; 3 58.42,50.8; 4 55.88,50.8; 5 53.34,50.8; 6 50.8,50.8; 7 48.26,50.8; 8 45.72,50.8; 10 39.116,50.8; 11 36.576,50.8; 12 34.036,50.8; 13 31.496,50.8; 14 28.956,50.8; 15 26.416,50.8; 16 23.876,50.8; 17 21.336,50.8; 18 18.796,50.8; 19 27.94,2.54; 20 30.48,2.54; 21 33.02,2.54; 22 35.56,2.54; 23 38.1,2.54; 24 40.64,2.54; 25 43.18,2.54; 28 53.34,2.54; 29 55.88,2.54; 30 58.42,2.54; 31 60.96,2.54; 32 63.5,2.54
FH12A-24S-0.5SH_DEV = smd 0.3 x 2.1: 1 5.75,3.65; 2 5.25,3.65; 3 4.75,3.65; 4 4.25,3.65; 5 3.75,3.65; 6 3.25,3.65; 7 2.75,3.65; 8 2.25,3.65; 9 1.75,3.65; 10 1.25,3.65; 11 0.75,3.65; 12 0.25,3.65; 13 -0.25,3.65; 14 -0.75,3.65; 15 -1.25,3.65; 16 -1.75,3.65; 17 -2.25,3.65; 18 -2.75,3.65; 19 -3.25,3.65; 20 -3.75,3.65; 21 -4.25,3.65; 22 -4.75,3.65; 23 -5.25,3.65; 24 -5.75,3.65
CHIPLED_0805 = smd 2 x 1.2: A -1.45,0; C 1.45,0
MBR0530_DEV = smd 1.8 x 1: 1 -2.135,0; 2 2.135,0
NLCV25T_DEV = smd 1.6 x 1.5: 1 -1.55,0; 2 1.55,0
SOT323_DEV = smd 0.56 x 1.8: 1 -0.65,-1.4; 2 0.65,-1.4; 3 0,1.4
SKRPACE010_DEV = smd 1.75 x 0.65: 1 -2.425,1.075; 2 2.425,1.075; 3 -2.425,-1.075; 4 2.425,-1.075
LQFP144_DEV = smd 2.2 x 0.3: 1 -11.15,8.75; 2 -11.15,8.25; 3 -11.15,7.75; 4 -11.15,7.25; 5 -11.15,6.75; 6 -11.15,6.25; 7 -11.15,5.75; 8 -11.15,5.25; 9 -11.15,4.75; 10 -11.15,4.25; 11 -11.15,3.75; 12 -11.15,3.25; 13 -11.15,2.75; 14 -11.15,2.25; 15 -11.15,1.75; 16 -11.15,1.25; 17 -11.15,0.75; 18 -11.15,0.25; 19 -11.15,-0.25; 20 -11.15,-0.75; 21 -11.15,-1.25; 22 -11.15,-1.75; 23 -11.15,-2.25; 24 -11.15,-2.75; 25 -11.15,-3.25; 26 -11.15,-3.75; 27 -11.15,-4.25; 28 -11.15,-4.75; 29 -11.15,-5.25; 30 -11.15,-5.75; 31 -11.15,-6.25; 32 -11.15,-6.75; 33 -11.15,-7.25; 34 -11.15,-7.75; 35 -11.15,-8.25; 36 -11.15,-8.75; 73 11.15,-8.75; 74 11.15,-8.25; 75 11.15,-7.75; 76 11.15,-7.25; 77 11.15,-6.75; 78 11.15,-6.25; 79 11.15,-5.75; 80 11.15,-5.25; 81 11.15,-4.75; 82 11.15,-4.25; 83 11.15,-3.75; 84 11.15,-3.25; 85 11.15,-2.75; 86 11.15,-2.25; 87 11.15,-1.75; 88 11.15,-1.25; 89 11.15,-0.75; 90 11.15,-0.25; 91 11.15,0.25; 92 11.15,0.75; 93 11.15,1.25; 94 11.15,1.75; 95 11.15,2.25; 96 11.15,2.75; 97 11.15,3.25; 98 11.15,3.75; 99 11.15,4.25; 100 11.15,4.75; 101 11.15,5.25; 102 11.15,5.75; 103 11.15,6.25; 104 11.15,6.75; 105 11.15,7.25; 106 11.15,7.75; 107 11.15,8.25; 108 11.15,8.75 | smd 0.3 x 2.2: 37 -8.75,-11.15; 38 -8.25,-11.15; 39 -7.75,-11.15; 40 -7.25,-11.15; 41 -6.75,-11.15; 42 -6.25,-11.15; 43 -5.75,-11.15; 44 -5.25,-11.15; 45 -4.75,-11.15; 46 -4.25,-11.15; 47 -3.75,-11.15; 48 -3.25,-11.15; 49 -2.75,-11.15; 50 -2.25,-11.15; 51 -1.75,-11.15; 52 -1.25,-11.15; 53 -0.75,-11.15; 54 -0.25,-11.15; 55 0.25,-11.15; 56 0.75,-11.15; 57 1.25,-11.15; 58 1.75,-11.15; 59 2.25,-11.15; 60 2.75,-11.15; 61 3.25,-11.15; 62 3.75,-11.15; 63 4.25,-11.15; 64 4.75,-11.15; 65 5.25,-11.15; 66 5.75,-11.15; 67 6.25,-11.15; 68 6.75,-11.15; 69 7.25,-11.15; 70 7.75,-11.15; 71 8.25,-11.15; 72 8.75,-11.15; 109 8.75,11.15; 110 8.25,11.15; 111 7.75,11.15; 112 7.25,11.15; 113 6.75,11.15; 114 6.25,11.15; 115 5.75,11.15; 116 5.25,11.15; 117 4.75,11.15; 118 4.25,11.15; 119 3.75,11.15; 120 3.25,11.15; 121 2.75,11.15; 122 2.25,11.15; 123 1.75,11.15; 124 1.25,11.15; 125 0.75,11.15; 126 0.25,11.15; 127 -0.25,11.15; 128 -0.75,11.15; 129 -1.25,11.15; 130 -1.75,11.15; 131 -2.25,11.15; 132 -2.75,11.15; 133 -3.25,11.15; 134 -3.75,11.15; 135 -4.25,11.15; 136 -4.75,11.15; 137 -5.25,11.15; 138 -5.75,11.15; 139 -6.25,11.15; 140 -6.75,11.15; 141 -7.25,11.15; 142 -7.75,11.15; 143 -8.25,11.15; 144 -8.75,11.15
DFN6-3X3_ = smd 1.5 x 0.45: 1 -1.8,0.95; 2 -1.8,0; 3 -1.8,-0.95; 4 1.8,-0.95; 5 1.8,0; 6 1.8,0.95 | smd 1.6 x 2.5: EXP 0,0
SSOP8-DGK_DEV = smd 0.3 x 2: 1 -0.975,-2.65; 2 -0.325,-2.65; 3 0.325,-2.65; 4 0.975,-2.65; 5 0.975,2.65; 6 0.325,2.65; 7 -0.325,2.65; 8 -0.975,2.65
SC-70-5_DEV = smd 0.4 x 2: 1 -0.65,-1.425; 2 0,-1.425; 3 0.65,-1.425; 4 0.65,1.425; 5 -0.65,1.425
SOP_8L = smd 0.6 x 2.2: 1 -1.905,-3.85; 2 -0.635,-3.85; 3 0.635,-3.85; 4 1.905,-3.85; 5 1.905,3.85; 6 0.635,3.85; 7 -0.635,3.85; 8 -1.905,3.85
DQFN20_DEV = smd 2.9 x 1: 0 0,0 | smd 1.7 x 0.24: 1 -2.7,-0.25; 10 2.7,-0.25; 11 2.7,0.25; 20 -2.7,0.25 | smd 0.24 x 1.7: 2 -1.75,-1.7; 3 -1.25,-1.7; 4 -0.75,-1.7; 5 -0.25,-1.7; 6 0.25,-1.7; 7 0.75,-1.7; 8 1.25,-1.7; 9 1.75,-1.7; 12 1.75,1.7; 13 1.25,1.7; 14 0.75,1.7; 15 0.25,1.7; 16 -0.25,1.7; 17 -0.75,1.7; 18 -1.25,1.7; 19 -1.75,1.7
SO8N = smd 0.6 x 2.2: 1 -1.905,-3.15; 2 -0.635,-3.15; 3 0.635,-3.15; 4 1.905,-3.15; 5 1.905,3.15; 6 0.635,3.15; 7 -0.635,3.15; 8 -1.905,3.15
NX3215_DEV = smd 1.9 x 1.9: 1 -1.65,0; 2 1.65,0
NX3225_DEV = smd 2.2 x 2.7: 1 -1.4,0; 2 1.4,0

### Placement (x,y rotation side)
C1  36.83,24.13 90 bottom
C2  33.79,24.13 90 bottom
C3  31.11,24.13 90 bottom
C4  26.67,21.83 180 bottom
C5  26.67,27.3 180 bottom
C6  26.67,29.84 180 bottom
C7  24.77,34.29 270 bottom
C8  30.48,34.29 270 bottom
C9  33.02,34.29 270 bottom
C10  36.83,35.56 0 bottom
C11  36.83,33.02 0 bottom
C12  36.83,29.84 0 bottom
C13  57.78,26.04 180 bottom
C14  57.78,21.91 180 bottom
C15  57.78,33.27 180 bottom
C16  57.78,30.48 180 bottom
C17  70.48,46.99 0 top
C18  39.21,12.06 180 bottom
C19  48.26,36.83 180 bottom
C20  27.62,34.29 270 bottom
C21  26.67,24.41 180 bottom
C22  26.67,12.06 0 bottom
C23  46.67,10.79 180 bottom
C24  47.31,7.3 180 bottom
C25  39.37,26.04 90 bottom
C26  60.96,41.91 0 top
C27  72.39,35.24 180 bottom
C28  10.87,22.38 0 bottom
C29  5.08,6.99 180 bottom
C30  72.39,39.05 180 bottom
C31  72.39,24.45 180 bottom
C32  64.14,33.02 0 bottom
C33  72.39,32.38 180 bottom
C34  72.39,27.94 180 bottom
C35  64.14,28.89 0 bottom
C36  64.14,24.13 0 bottom
C37  62.87,12.06 270 top
C38  63.5,17.78 270 bottom
C39  63.5,9.53 270 bottom
C40  33.66,6.99 0 bottom
C41  33.66,9.53 0 bottom
C42  3.17,13.97 90 bottom
C45  4.52,24.69 180 bottom
C46  4.52,30 180 bottom
C47  15.72,35.56 270 bottom
C48  18.41,35.4 270 bottom
C49  5.56,13.97 90 bottom
CN1  12.7,7.62 0 top
CN2  8.89,47.94 90 top
CN3  8.89,36.83 90 top
CN5  0,0 0 top
CN7  72.39,33.02 90 top
D1  56.52,23.5 0 top
D2  56.52,26.67 0 top
D3  56.52,29.84 0 top
D4  57.15,13.34 0 top
D5  67.31,19.05 270 top
D6  70.48,12.06 90 top
D7  66.67,12.06 90 top
FB1  44.45,41.27 0 top
L1  62.23,20.32 270 top
Q1  72.39,17.78 90 top
R1  48.26,25.72 0 bottom
R2  48.26,22.54 0 bottom
R3  48.26,33.34 0 bottom
R4  48.26,30.16 0 bottom
R5  8.57,26.04 90 bottom
R6  63.5,6.67 0 top
R7  70.48,6.67 180 top
R8  39.37,12.7 0 top
R9  48.26,39.37 180 bottom
R10  32.38,12.06 0 bottom
R11  60.96,39.37 180 top
R12  60.96,36.83 180 top
R13  50.16,26.67 180 top
R14  50.16,29.84 180 top
R15  50.16,23.5 180 top
R16  52.07,12.06 270 top
R17  51.59,16.51 0 top
R18  56.52,19.68 180 top
R19  10.79,31.43 180 bottom
R20  57.15,9.53 180 top
R21  70.48,44.45 180 top
R22  72.39,21.59 180 top
R23  74.3,12.06 90 top
R24  57.15,16.51 0 top
R25  23.81,3.81 0 bottom
R26  57.15,6.99 180 top
R27  13.34,43.81 270 bottom
R28  20.64,43.81 270 bottom
R29  15.24,35.56 90 top
SW1  70.48,50.8 180 top
SW2  70.48,2.54 0 top
U1  31.75,29.21 180 top
U2  39.37,8.89 0 top
U3  60.96,45.09 90 top
U4  50.16,19.68 90 top
U5  5.08,13.34 90 top
U6  7.62,19.05 270 top
U7  5.71,27.3 0 top
U9  17.14,43.81 0 top
X1  53.34,24.13 270 bottom
X2  53.34,31.75 270 bottom

### Tracks (layer width: path | path; a pad name or v marks a point on that pad's centre or on a via)
0V  (via drill 0.6, 1 pad 1.42)
  Top 0.254: U7.10 9.46,27.05 v10.79,25.72
  Top 0.305: U1.51 33.5,38.25 v34.21,37.54 | U1.130 33.5,20 v32.46,21.04 31.46,22.04 29.96,22.04 28.5,20.58 U1.120 | U1.94 22.13,27.46 v23.18,28.54 | U1.83 22.6,32.96 v23.18,33.54 | U1.61 28.5,39 28.96,38.54 29.96,38.54 v30.96,37.54 | SW1.4 SW1.3 73.86,51.88 v74.93,50.8 74.93,48.26 73.66,46.99 C17.2 | U4.2 53.34,19.68 54.45,20.8 56.5,20.8 R18.1 57.97,20.04 D1.C 57.94,23.52 57.94,26.65 D2.C 57.97,26.85 v59.37,28.26 57.97,29.66 D3.C | U1.38 40,41.91 40.48,42.39 41.22,42.39 v41.25,42.42 | U3.7 60.63,44.76 | 60.63,44.76 60.96,45.09 | U3.6 60.63,45.41 60.96,45.09 | U3.5 59.19,46.06 59.21,46.04 60.64,46.04 60.96,45.72 | 60.96,45.72 60.96,45.09 | U3.4 61.3,46.06 60.96,45.72 | CN7.8 73.37,35.27 74.3,36.2 | CN7.17 70.46,30.77 74.3,34.61 74.3,36.2 | 74.3,36.2 v74.3,37.47 | D6.1 73.46,9.93 R23.1 75.56,12.04 75.56,20.64 | R21.1 71.91,44.45 74.3,42.07 v74.3,37.47 | 75.56,20.64 75.56,36.2 v74.3,37.47 | R22.1 74.61,21.59 75.56,20.64 | R7.1 73.03,6.67 v74.3,5.4 | U1.16 40.66,27.96 v40.64,27.94 | U1.107 22.39,20.96 v23.5,22.07 | 60.63,44.76 60.64,44.75 v60.64,43.34 C26.2 | U9.4 19.05,39.53 19.68,38.89 20.48,38.89 20.95,39.37 v20.95,40.64 | CN1.2 9.3,9.94 v10.16,10.79 | R8.2 v43.02,12.7 | U2.2 31.59,8.89 v30.32,10.16 | U5.2 5.4,13.34 5.08,13.02 v5.08,10.48 | U6.4 v6.99,17.14 | D4.C 58.6,13.15 v60.33,11.43
  other vias: 39.37,8.89
  pour Bottom (isolate 0.406, rank 6): -1.27,54.61 77.47,54.61 77.47,-1.27 -1.27,-1.27
!CS!
  Top 0.254: U7.3 4.46,21.02 U6.1
!OE!  (via drill 0.6)
  Top 0.254: v9.21,28.89 8.41,28.1 U7.11
  Bottom 0.254: R5.2 8.57,28.26 v9.21,28.89
+1V8  (via drill 0.6)
  Top 0.254: 2.54,18.41 1.43,19.53 1.43,25.72 v1.75,26.04 1.75,26.75 2.06,27.07 3,27.07 U7.1
  Top 0.305: U5.5 3.79,12.69 3.81,12.7 2.54,12.7 | 2.54,12.7 1.59,13.65 1.59,17.46 2.54,18.41 U6.3 7.06,18.41 9.37,16.11 12.62,16.11 13.65,17.14 13.65,18.81 | v1.91,12.06 2.54,12.7 | 13.65,18.81 13.65,20.08 12.78,20.95 | 12.78,20.95 v13.41,21.59 | U6.8 12.78,20.95 | U6.7 12.78,19.68 13.65,18.81
  Bottom 0.254: C45.1 3.1,24.69 v1.75,26.04
  Bottom 0.305: C42.1 2.71,12.87 v1.91,12.06 1.91,8.46 C29.1 | C28.1 11.99,22.38 v13.41,21.59
+3V3  (via drill 0.6)
  Top 0.305: v47.31,13.81 47.31,17.78 47.3,17.79 47.3,18.8 47.53,19.04 U4.5 | v44.61,13.34 44.29,13.02 44.29,8.89 43.34,7.94 40.67,7.94 U2.4 | CN2.3 6.67,46.72 v6.67,40.01 0.48,33.81 0.48,5.4 5.4,0.48 28.42,0.48 CN5.20 | R24.1 55.1,15.56 50.8,15.56 v50.32,15.08
  Top 0.406: CN5.22 35.56,4.45 v37.47,6.35 40.64,6.35 41.17,6.88 U2.4
  Bottom 0.305: v47.31,13.81 46.99,13.49 | v37.47,6.35 36.83,6.99 C40.1 C41.1 34.45,9.53 33.5,10.48 33.5,12.05 R10.1 | CN3.3 8.84,37.83 v6.67,40.01 | v44.61,13.34 46.83,13.34 v47.31,13.81 | v47.31,13.81 49.05,13.81 v50.32,15.08
  Bottom 0.406: CN5.22 34.29,3.81 31.75,3.81 | 31.75,3.81 R25.1 | CN5.20 31.75,3.81
AGND  (via drill 0.6)
  Top 0.305: U1.31 46.97,35.46 48.26,36.75 v48.26,38.1
  Bottom 0.305: R9.2 49.36,39.2 v48.26,38.1 49.36,37 C19.2
AVDD  (via drill 0.6)
  Top 0.305: CN5.16 23.95,50.8 25.4,52.25 42.52,52.25 v43.18,51.59 | v43.18,46.35 43.18,46.2 44.13,45.24 46.04,45.24 46.67,44.61 46.67,42.2 FB1.2 46.67,40.35 46.67,37.47 v45.56,36.35 | U1.32 45.17,35.96 v45.56,36.35 | U1.33 45.45,36.46 v45.56,36.35
  Bottom 0.305: v43.18,51.59 v43.18,46.35 | 47.15,36.84 C19.1 46.04,36.83 v45.56,36.35
BOOT0  (via drill 0.6)
  Top 0.305: U1.138 37.5,15.99 v37.07,15.56 | v39.21,14.61 39.21,13.64 R8.1
  Bottom 0.305: v37.07,15.56 37.7,16.19 38.66,16.19 39.21,15.64 v39.21,14.61
GDR  (via drill 0.6)
  Top 0.305: 74.27,13.37 R23.2 74.3,13.81 74.93,14.45 74.93,16.83 74.61,17.14 73.81,17.14 | 73.81,17.14 Q1.1 | 73.81,17.14 73.03,17.14 72.39,17.78 72.39,18.89 70.96,20.32 69.22,20.32 68.58,20.95 v68.58,22.23 | 66.67,38.58 v66.36,38.89 66.98,38.27 CN7.2
  Bottom 0.305: v68.58,22.23 68.58,25.08 68.1,25.56 68.1,37.15 v66.36,38.89
LED1
  Top 0.305: R15.2 49.21,23.5 | U4.3 U4.4 48.74,23.17 R15.2 | 48.94,23.37 R15.2
N$1
  Bottom 0.305: C15.1 56.56,33.15 X2.1 53.15,33.34 R3.1
N$2
  Bottom 0.305: R2.1 49.42,22.48 X1.2 56.11,22.48 C14.1
N$3
  Bottom 0.305: R1.1 49.42,25.78 X1.1 56.43,25.78 C13.1
N$4
  Top 0.305: R13.1 D2.A
N$5
  Bottom 0.305: C16.1 56.55,30.35 X2.2 53.15,30.16 R4.1
N$6
  Top 0.305: SW2.2 SW2.1 66.23,3.62 64.6,5.25 R6.2 R7.2
N$7
  Top 0.305: R14.1 D3.A
N$8
  Top 0.305: CN7.1 69.89,38.77 70.48,39.37 70.48,43.35 R21.2
N$9
  Top 0.305: R18.2 54.77,19.04 U4.1 51.08,19.05 50.44,19.05 50.12,18.73 50.12,17.94 50.6,17.46 52.07,17.46 52.69,16.84 R17.2
N$10
  Top 0.305: R15.1 D1.A
N$11
  Top 0.305: R16.1 55.53,13.16 D4.A
N$13
  Top 0.305: C37.1 62.87,13.97 62.23,14.61 L1.2 66.32,18.77 67.31,17.78 D5.2 67.31,17.14 67.94,17.78 Q1.3
N$14
  Top 0.305: D6.2 66.67,10.39 D7.1 63.7,9.93 C37.2
NRST  (via drill 0.6)
  Top 0.305: SW1.1 SW1.2 68.22,49.53 | 68.22,49.53 63.18,49.53 60.64,46.99 53.98,46.99 50.64,43.66 v50.64,34.69 | 68.22,49.53 68.58,49.53 69.37,48.74 69.37,47 C17.1 | v40.64,31.43 41.67,32.46 U1.25 44.52,32.46 46.51,34.45 v48.26,34.45 | v38.1,31.43 26.51,19.84 22.23,19.84 19.68,17.3 19.68,16.03 v16.03,12.38 | v14.45,10.79 12.7,9.05 CN1.4 12.7,6.99 13.97,5.71 29.84,5.71 CN5.21
  Bottom 0.305: v38.1,31.43 v40.64,31.43 | v48.26,34.45 50.4,34.45 v50.64,34.69 | v14.45,10.79 v16.03,12.38
PA3  (via drill 0.6)
  Top 0.305: v44.77,16.99 45.4,16.35 45.4,7.94 CN5.27 | U1.37 40.5,38.4 v40.8,38.1
  Bottom 0.305: v44.77,16.99 44.77,21.27 43.5,22.54 43.5,33.5 41.27,35.72 41.27,37.62 v40.8,38.1
PA5  (via drill 0.6)
  Top 0.305: U1.41 38.5,42.55 40.56,44.61 v41.99,44.61 | CN7.13 55.57,32.77 53.66,34.69 v53.66,39.85
  Bottom 0.305: CN5.14 30.86,52.7 36.51,52.7 37.78,51.44 37.78,49.29 38.73,48.34 38.73,47.86 v41.99,44.61 43.89,42.7 50.8,42.7 v53.66,39.85
PA6  (via drill 0.6)
  Top 0.305: U1.42 38,43.16 v38.34,43.5
  Bottom 0.305: CN5.13 31.5,50.86 32.7,52.07 34.61,52.07 35.24,51.44 35.24,50.32 37.78,47.78 37.78,44.05 v38.34,43.5
PA7  (via drill 0.6)
  Top 0.305: U1.43 37.5,43.22 v37.23,43.5 37.23,43.58 37.94,44.29 39.37,44.29 40.56,45.48 42.23,45.48 44.13,43.58 v45.64,43.58 | CN7.14 55.2,32.27 52.78,34.69 v52.78,42.07
  Bottom 0.305: CN5.12 34.04,50.74 37.23,47.55 v37.23,43.5 | v45.64,43.58 51.28,43.58 v52.78,42.07
PA15  (via drill 0.6)
  Top 0.254: U7.18 4.46,29.94 7.06,32.54 9.45,32.54 v11.91,30.08
  Top 0.305: U1.110 23.5,16.36 23.02,15.88 21.75,15.88 v21.11,16.51
  Bottom 0.305: v21.11,16.51 21.11,16.99 12.54,25.56 12.54,29.45 v11.91,30.08
PB0  (via drill 0.6)
  Top 0.305: v48.1,16.51 R17.1 | U1.46 36,38.77 36.51,38.26 38.26,38.26 v40.01,36.51
  Bottom 0.305: v48.1,16.51 47.78,16.19 44.45,16.19 43.97,16.67 43.97,21.27 42.86,22.38 42.86,33.02 40.01,35.88 v40.01,36.51
PB7  (via drill 0.6)
  Top 0.305: U1.137 36.99,18.45 36.99,16.67 v35.88,15.56 | R13.2 47.78,25.39 47.78,21.59 43.34,17.14 v41.59,17.14
  Bottom 0.305: v41.59,17.14 40.96,16.83 37.15,16.83 v35.88,15.56
PB8  (via drill 0.6)
  Top 0.305: U1.139 38,15.3 35.4,12.7 21.75,12.7 v20.32,14.13 | v16.35,18.1 16.35,18.73 16.67,19.05 16.67,28.73 13.49,31.91 13.49,32.7 12.54,33.66 12.54,48.42 14.92,50.8 CN5.18 | CN3.1 8.87,33.83 7.62,35.08 7.62,43.67 CN2.1
  Bottom 0.305: v16.35,18.1 v20.32,14.13 | CN2.1 8.91,44.94 14.76,50.8 CN5.18
PB9  (via drill 0.6)
  Top 0.305: U1.140 38.5,15.01 35.56,12.06 20.8,12.06 v19.53,13.34 | v15.56,17.3 15.56,18.89 16.03,19.37 16.03,28.42 12.86,31.59 12.86,32.38 11.91,33.34 | 11.91,33.34 11.91,45.72 | 11.91,45.72 11.91,48.58 15.72,52.39 19.75,52.39 CN5.17 | CN3.2 9.41,35.83 11.91,33.34 | CN2.2 10.68,46.94 11.91,45.72
  Bottom 0.305: v15.56,17.3 v19.53,13.34
PB10  (via drill 0.6)
  Top 0.305: U1.69 24.5,43.76 23.81,44.45 19.84,44.45 18.73,43.34 16.67,43.34 v15.88,44.13 16.51,44.77 U9.7
  Bottom 0.305: v15.88,44.13 14.12,44.13 R27.1
PB11  (via drill 0.6)
  Top 0.305: v18.41,44.13 19.05,44.77 U9.5 | U1.70 24,43.15 v23.5,43.66
  Bottom 0.305: v18.41,44.13 19.05,44.77 20.49,44.77 R28.1 20.65,44.93 22.23,44.93 v23.5,43.66
PB14  (via drill 0.6)
  Top 0.305: R14.2 49.05,29.86 49.05,31.83 51.91,34.69 51.91,35.24 v51.59,35.56 | v37.94,37.31 37.94,36.51 37.47,36.04 24.29,36.04 23.36,36.96 U1.75
  Bottom 0.305: v37.94,37.31 37.94,38.26 38.73,39.05 41.27,39.05 41.91,38.42 41.91,36.04 42.39,35.56 v51.59,35.56
PC0  (via drill 0.6)
  Top 0.305: v45.56,17.78 45.88,17.46 45.88,10 CN5.28 | U1.26 44.31,32.96 45.56,34.21 v45.56,34.69
  Bottom 0.305: v45.56,17.78 45.56,21.27 43.97,22.86 43.97,33.1 v45.56,34.69
PC10  (via drill 0.6)
  Top 0.305: U1.111 24,15.11 v23.97,15.08
  Bottom 0.305: v23.97,15.08 13.18,25.88 13.18,30.15 R19.2
PC10_D  (via drill 0.6)
  Top 0.254: U7.16 5.46,29.91 7.3,31.75 v7.94,31.75
  Bottom 0.254: R19.1 8.26,31.43 v7.94,31.75
PC11  (via drill 0.6)
  Top 0.254: U7.14 6.46,29.96 7.3,30.8 9.05,30.8 12.06,27.78 13.65,27.78 v13.97,27.46
  Top 0.305: U1.112 24.5,15.82 v25.24,15.08
  Bottom 0.305: v25.24,15.08 15.56,24.45 13.97,26.04 v13.97,27.46
PC12  (via drill 0.6)
  Top 0.254: v14.92,26.67 12.54,26.67 8.97,30.24 7.7,30.24 7.46,30.01 U7.12
  Top 0.305: U1.113 25,16.59 v26.51,15.08
  Bottom 0.305: v26.51,15.08 v14.92,26.67
PC13  (via drill 0.6)
  Top 0.305: U1.7 44.48,23.46 v45.56,22.38 | R6.1 61.44,7.63 61.44,13.18 59.85,14.76 v52.55,14.76
  Bottom 0.305: v45.56,22.38 45.56,22.23 46.35,21.43 46.35,18.57 47.62,17.3 49.53,17.3 52.07,14.76 v52.55,14.76
PC14  (via drill 0.6)
  Top 0.305: U1.8 45.26,23.96 v45.72,23.5
  Bottom 0.305: v45.72,23.5 46.67,22.54 R2.2
PC15  (via drill 0.6)
  Top 0.305: U1.9 45.41,24.46 v45.72,24.77
  Bottom 0.305: v45.72,24.77 46.67,25.72 R1.2
PD8  (via drill 0.6)
  Top 0.305: U1.77 23.1,35.96 v23.18,36.04 | v18.1,30.32 17.3,29.53 17.3,17.78 15.4,15.88 v15.4,14.29 | CN1.6 16.1,10.23 v16.67,10.79
  Bottom 0.305: v23.18,36.04 22.54,36.04 20.8,34.29 20.8,33.02 v18.1,30.32 | v16.67,10.79 16.99,11.11 16.99,12.7 v15.4,14.29
PD9  (via drill 0.6)
  Top 0.305: U1.78 22.48,35.46 v23.18,34.77 | CN1.7 17.8,10.78 v17.78,10.79 | v18.1,29.05 17.94,28.89 17.94,17.62 16.35,16.03 v16.35,15.24
  Bottom 0.305: v23.18,34.77 22.23,34.77 21.27,33.81 21.27,32.23 v18.1,29.05 | v17.78,10.79 17.78,13.02 16.35,14.45 v16.35,15.24
PD14  (via drill 0.6)
  Top 0.305: U1.85 15.51,31.96 v15.08,32.38 | CN5.11 35.31,49.53 30.64,49.53 30.32,49.21 14.29,49.21 13.34,48.26 v13.34,34.13 | CN7.12 56.34,33.27 54.61,35 v54.61,37.78
  Bottom 0.305: CN5.11 37.31,50.07 37.31,49.05 38.26,48.1 38.26,47.15 43.5,41.91 50.48,41.91 v54.61,37.78 | v13.34,34.13 v15.08,32.38
PD15  (via drill 0.6)
  Top 0.305: U1.86 14.74,31.46 14.13,32.07 14.13,48.1 14.61,48.58 30.64,48.58 30.96,48.9 37.15,48.9 39.05,50.8 CN5.10 | CN7.11 56.72,33.77 55.4,35.08 55.4,38.26 54.61,39.05 54.61,42.55 v52.7,44.45
  Bottom 0.305: CN5.10 40.7,52.39 46.35,52.39 46.99,51.75 46.99,46.75 48.66,45.24 51.91,45.24 v52.7,44.45
PE0  (via drill 0.6)
  Top 0.305: U1.141 39,15.93 40.32,14.61 v43.02,14.61 | v48.1,14.61 48.74,13.97 48.74,10.32 52.07,6.99 R26.2
  Bottom 0.305: v48.1,14.61 v43.02,14.61
PE1  (via drill 0.6)
  Top 0.305: U1.142 39.5,16.22 40.16,15.56 v43.66,15.56 | v48.74,15.56 49.37,14.92 49.37,10.48 50.32,9.53 R20.2
  Bottom 0.305: v48.74,15.56 v43.66,15.56
PE9  (via drill 0.6)
  Top 0.305: U1.60 29,42.97 v30.64,44.61 | v32.86,44.61 33.34,44.61 34.61,45.88 38.42,45.88 40.16,47.62 46.51,47.62 46.83,47.31 v47.78,47.31
  Bottom 0.305: v32.86,44.61 v30.64,44.61 | CN5.7 48.26,47.78 v47.78,47.31
PE11  (via drill 0.6)
  Top 0.305: v33.5,46.83 37.78,46.83 39.53,48.58 48.9,48.58 49.21,48.26 v50.16,48.26 | U1.64 27,43.19 30.64,46.83 v31.04,46.83
  Bottom 0.305: v31.04,46.83 v33.5,46.83 | CN5.6 50.8,48.9 v50.16,48.26
PE13
  Top 0.305: CN5.4 54.61,49.53 38.81,49.53 37.54,48.26 31.27,48.26 26,42.99 U1.66
PE15  (via drill 0.6)
  Top 0.305: v22.86,42.7 15.56,42.7 15.24,42.39 U9.1 | 25.24,43.66 v25.4,43.81 25,43.41 U1.68
  Bottom 0.305: v25.4,43.81 24.29,42.7 v22.86,42.7
PF12  (via drill 0.6)
  Top 0.305: U1.50 34,42.1 34.92,43.02 34.92,44.29 35.4,44.77 39.05,44.77 40.62,46.34 v41.89,46.34 42.09,46.34 43.97,44.45 v44.77,44.45 | CN7.10 57.09,34.27 56.71,34.65 56.04,35.32 v56.04,40.01
  Bottom 0.305: v41.89,46.34 41.85,46.34 41.67,46.51 41.67,50.78 CN5.9 | v44.77,44.45 51.59,44.45 v56.04,40.01
PF13  (via drill 0.6)
  Top 0.305: U1.53 32.5,42.98 34.92,45.4 38.73,45.4 40.48,47.15 44.29,47.15 44.61,46.83 v45.4,46.83
  Bottom 0.305: CN5.8 45.72,47.15 v45.4,46.83
PF14  (via drill 0.6)
  Top 0.305: U1.54 32,45.34 32.7,46.04 33.97,46.04 34.29,46.35 38.1,46.35 39.85,48.1 48.58,48.1 49.21,47.47 51.59,47.47 v52.39,48.26
  Bottom 0.305: CN5.5 53.34,49.21 v52.39,48.26
PF15
  Top 0.305: U1.55 31.5,46.1 33.02,47.62 37.78,47.62 39.21,49.05 56.67,49.05 CN5.3
PG9  (via drill 0.6)
  Top 0.305: CN5.1 60.33,47.62 53.82,47.62 49.77,43.58 49.77,33.58 47.31,31.11 47.31,21.91 43.66,18.26 v41.59,18.26 | U1.124 30.5,16.17 v31.59,15.08
  Bottom 0.305: v41.59,18.26 34.92,18.26 33.81,17.14 33.81,16.19 32.7,15.08 v31.59,15.08
PG14  (via drill 0.6)
  Top 0.305: CN5.2 58.42,48.26 53.66,48.26 49.13,43.74 49.13,33.89 46.83,31.59 46.83,22.23 43.97,19.37 v41.59,19.37 | U1.129 33,16.53 v32.38,15.88
  Bottom 0.305: v41.59,19.37 41.12,18.89 34.61,18.89 33.02,17.3 33.02,16.51 v32.38,15.88
PH0  (via drill 0.6)
  Top 0.305: U1.23 45.38,31.46 v45.56,31.27
  Bottom 0.305: R4.2 46.67,30.16 v45.56,31.27
PH1  (via drill 0.6)
  Top 0.305: U1.24 45.14,31.96 v45.56,32.38
  Bottom 0.305: R3.2 46.51,33.34 v45.56,32.38
PREVGH  (via drill 0.6)
  Top 0.305: CN7.21 66.87,28.77 v65.41,27.3 64.45,26.35 64.45,22.23 65.41,21.27 67.22,21.27 D5.1
  Bottom 0.305: v65.41,27.3 65.41,28.41 C35.1
PREVGL  (via drill 0.6)
  Top 0.305: CN7.23 67.14,27.77 v65.41,26.04 v65.41,22.7 | D7.2 66.67,14.61 65.41,15.88 v65.41,17.78
  Bottom 0.305: v65.41,26.04 65.25,25.88 65.25,24.14 C36.1 | v65.41,17.78 v65.41,22.7
RESE  (via drill 0.6)
  Top 0.305: CN7.3 66.66,37.77 v66.36,37.47 | Q1.2 73.01,18.43 73.01,19.67 R22.2 70.48,21.59 v67.31,24.77
  Bottom 0.305: v66.36,37.47 66.36,36.83 67.31,35.72 v67.31,24.77
RX_AUX
  Top 0.305: CN5.31 58.25,5.25 R26.1
SCLK  (via drill 0.6)
  Top 0.254: U7.5 5.46,21.52 v5.64,21.35
  Top 0.305: v9.21,18.41 U6.6
  Bottom 0.305: v5.64,21.35 v9.21,18.41
SI
  Top 0.254: U6.5 9.29,17.14 7.46,18.97 U7.9
SO
  Top 0.254: U7.7 6.46,21.07 5.08,19.68 U6.2
SWO  (via drill 0.6)
  Top 0.305: U1.133 35,14.68 33.81,13.49 v22.23,13.49 | v20.16,11.43 19.53,10.79 19.53,7.3 18.73,6.51 15.24,6.51 14.4,7.35 CN1.5
  Bottom 0.305: v20.16,11.43 v22.23,13.49
TCK
  Top 0.305: U1.109 23,18.91 22.86,19.05 22.38,19.05 20.32,16.99 20.32,15.24 16.67,11.59 9.68,11.59 7.6,9.51 CN1.1
TMS  (via drill 0.6)
  Top 0.305: U1.105 20.57,21.99 19.21,21.99 18.57,21.35 18.57,16.03 14.92,12.38 v13.02,12.38 | CN1.3 11,10.37 v11.43,10.79
  Bottom 0.305: v11.43,10.79 v13.02,12.38
TSCL  (via drill 0.6)
  Top 0.305: R11.1 62.07,39.37 | U3.2 61.91,44.76 61.44,44.29 61.44,43.5 62.07,42.86 63.02,42.86 63.5,42.39 63.5,40.32 62.55,39.37 R11.1 | 62.07,39.36 R11.1 | CN7.6 65.81,36.27 v65.41,36.67 | v62.71,38.1 62.23,38.58 62.23,39.34 R11.1
  Bottom 0.305: v62.71,38.1 64.14,36.67 v65.41,36.67
TSDA
  Top 0.305: CN7.7 63.32,35.77 R12.1 | U3.1 62.37,44.11 62.07,43.81 62.07,43.66 62.39,43.34 63.34,43.34 64.14,42.55 64.14,38.26 62.87,36.99 62.42,36.99 R12.1 | R12.1 62.55,36.83 | R12.1 62.26,37.18
TX_AUX
  Top 0.305: CN5.32 59.69,6.35 59.69,6.99 59.69,7.78 59.69,8.09 R20.1
VCAP_1  (via drill 0.6)
  Top 0.305: U1.71 23.5,39.05 v24.29,38.26
  Bottom 0.305: v24.29,38.26 26.86,35.69 C20.1
VCAP_2  (via drill 0.6)
  Top 0.305: U1.106 22.02,21.46 22.38,21.83 22.38,22.38 v23.5,23.5
  Bottom 0.305: C21.1 24.41,24.41 v23.5,23.5
VCC_EPD  (via drill 0.6)
  Top 0.305: U3.8 59.55,44.11 59.85,43.81 59.85,41.92 | 59.85,41.92 C26.1 | CN7.16 61.76,31.27 v61.59,31.43 | CN7.15 61.93,31.77 v61.59,31.43 | v61.59,31.43 60.64,30.48 60.64,20.32 | v64.14,20.95 63.22,21.87 L1.1 62.19,21.87 60.64,20.32 | 60.64,20.32 v60.64,16.99 60.17,16.51 R24.2 | 59.85,41.92 59.85,39.56 R11.2 R12.2 59.69,36.8 59.69,36.04 v60.48,35.24
  Bottom 0.305: v61.59,31.43 61.12,31.91 61.12,34.61 v60.48,35.24 | v64.14,20.95 64.14,19.71 C38.1 | C39.1 62.66,12.06 62.66,12.27 61.59,13.34 61.59,16.03 v60.64,16.99
VCC_MEM  (via drill 0.6)
  Top 0.254: 8.57,5.08 6.99,5.08 0.95,11.11 0.95,26.91 1.83,27.78 | U7.20 2.05,27.55 1.83,27.78 | 1.83,27.78 v1.83,28.42
  Top 0.305: v20.32,3.81 19.05,5.08 8.57,5.08 8.26,5.08 6.67,6.67 6.67,11.11 v6.35,11.43 6.67,11.75 6.67,12.55 6.52,12.7 | U5.3 8.56,13.98 8.89,13.65 8.89,13.02 8.57,12.7 6.52,12.7 | 6.52,12.7 U5.1
  Bottom 0.254: C46.1 v1.83,28.42
  Bottom 0.305: v20.32,3.81 R25.2 | C49.1 5.71,12.08 5.71,12.06 v6.35,11.43
VCC_STSAFE  (via drill 0.6)
  Top 0.305: U9.2 16.51,39.05 v15.88,38.42 15.24,37.78 R29.2
  Bottom 0.305: v15.88,38.42 15.88,41.91 | 15.88,41.91 15.07,42.72 R27.2 | v15.88,38.42 15.88,36.82 C47.1 | C48.1 18.41,37.39 17.38,38.42 v15.88,38.42 | R28.2 16.68,42.72 15.88,41.91
VCOM  (via drill 0.6)
  Top 0.305: CN7.24 70.2,27.27 70.48,26.99 v70.48,26.04
  Bottom 0.305: v70.48,26.04 70.48,25.05 C31.1
VDD  (via drill 0.6)
  Top 0.305: U1.144 40.5,19.5 40,20 | U1.6 41.29,22.96 v40.71,23.54 | U1.17 41.54,28.46 v40.21,29.79 | U1.30 41.15,34.96 v40.37,34.17 | v38.96,21.04 v38.96,21.05 40.1,21.05 40.71,21.66 v40.71,23.54 | v38.96,21.04 40,20 | v40.71,23.54 40.21,24.04 40.21,24.08 39.69,24.61 39.69,29.27 v40.21,29.79 | SW2.4 SW2.3 | v34.09,43.49 33,42.4 U1.52 33,38.08 v32.46,37.54 31.59,36.67 30.48,36.67 29.61,37.54 v29.21,37.54 | FB1.1 43.15,41.91 41.56,43.5 v40.64,43.5 39.53,42.39 39.53,39.99 U1.39 39.53,39.93 v39.53,38.1 40.8,36.83 40.8,34.6 v40.37,34.17 | v38.96,21.04 38.57,21.43 34.35,21.43 v33.96,21.04 34,21 U1.131 34,15.27 33.02,14.29 v29.53,14.29 29,14.81 U1.121 29,19.33 v30.71,21.04 | U1.62 28,38.75 v29.21,37.54 | 67.94,1.59 SW2.3 | SW2.3 67.39,0.79 35.32,0.79 34.29,1.83 34.29,3.81 v27.94,10.16 | v40.21,29.79 v40.21,29.8 | v40.37,34.17 39.69,33.5 39.69,31.35 | 39.69,31.35 39.69,30.31 v40.21,29.79 | v23.21,37.77 23.21,37.75 23.34,37.62 | U1.72 23,37.98 v23.21,37.77 | U1.143 40,20 | v23.21,37.77 23.83,37.15 28.82,37.15 v29.21,37.54 | 24.99,32.23 38.73,32.23 39.61,31.35 39.69,31.35 | 24.99,32.23 24.13,31.37 24.13,28.15 v23.18,27.2 | 24.99,32.23 23.26,32.23 23.19,32.29 v23.18,32.29 23.01,32.46 U1.84 16.43,32.46 15.24,33.66 R29.1 | U1.95 22.94,26.96 v23.18,27.2 | v23.18,27.2 23.18,25.16 24.53,23.81 24.53,21.43 v23.73,20.64 23.56,20.46 U1.108
  Bottom 0.305: v40.71,23.54 40.71,23.59 C25.1 | v40.21,29.79 37.98,29.79 C12.1 | C11.1 37.95,33.04 39.23,33.04 v40.37,34.17 | 37.96,35.59 C10.1 37.93,35.71 39.53,37.31 v39.53,38.1 | v29.21,37.54 29.71,37.04 29.71,35.52 C8.1 | v32.46,37.54 32.46,35.47 C9.1 | C7.1 24.46,35.7 24.46,36.52 v23.21,37.77 | v34.09,43.49 34.42,43.5 36.04,43.5 36.99,42.55 39.69,42.55 v40.64,43.5 | v38.96,21.04 v38.96,21.05 36.98,23.03 C1.1 | C2.1 33.79,22.57 33.97,22.38 33.97,21.05 v33.96,21.04 | C6.1 25.56,29.94 v23.18,32.29 | C3.1 31.11,21.45 v30.71,21.04 30.55,20.88 | R10.2 C22.1 | C22.1 27.94,12.04 v27.94,10.16 | C22.1 27.97,12.73 v29.53,14.29 | C5.1 23.28,27.3 v23.18,27.2 | v23.73,20.64 24.93,21.83 C4.1
VDD_CAP  (via drill 0.6)
  Top 0.305: CN7.18 65.46,30.27 v65.41,30.32
  Bottom 0.305: v65.41,30.32 65.41,32.99 C32.1
VGH  (via drill 0.6)
  Top 0.305: CN7.5 71.34,36.77 v71.44,36.67
  Bottom 0.305: v71.44,36.67 71.44,35.59 C27.1
VGL  (via drill 0.6)
  Top 0.305: CN7.4 70.61,37.27 v71.12,37.78
  Bottom 0.305: 71.91,39.04 C30.1 71.12,39.02 v71.12,37.78
VIN  (via drill 0.6)
  Top 0.305: 40.64,9.87 40.64,10.48 40.48,10.64 37.78,10.64 37.57,10.42 U2.1 36.2,9.84 35.56,10.48 v35.56,10.79 | R16.2 51.9,10.79 v50.16,10.79
  Top 0.406: 40.64,9.87 U2.6 40.67,9.84 v43.34,9.84
  Top 0.61: CN5.23 40.01,4.45 43.81,4.45 CN5.26
  Bottom 0.305: C18.1 36.04,12.06 35.56,11.59 v35.56,10.79 | C24.1 45.72,7.42 45.72,8.89 46.35,9.53 48.9,9.53 v50.16,10.79
  Bottom 0.406: 45.72,7.83 C24.1 45.61,7.57 v43.34,9.84 44.29,10.79 C23.1
  Bottom 0.61: CN5.26 45.72,7.83
VSH  (via drill 0.6)
  Top 0.305: CN7.20 70.07,29.27 71.6,30.8 v72.07,30.8
  Bottom 0.305: v72.07,30.8 72.07,32.07 71.75,32.38 C33.1
VSL  (via drill 0.6)
  Top 0.305: CN7.22 70.18,28.27 v71.44,29.53
  Bottom 0.305: C34.1 71.09,29.18 v71.44,29.53

### Text on the board
tNames: TX_AUX | RX_AUX